# Altium project ai_uwb_smart_flashlight.PrjPcb (part 2 of 6)
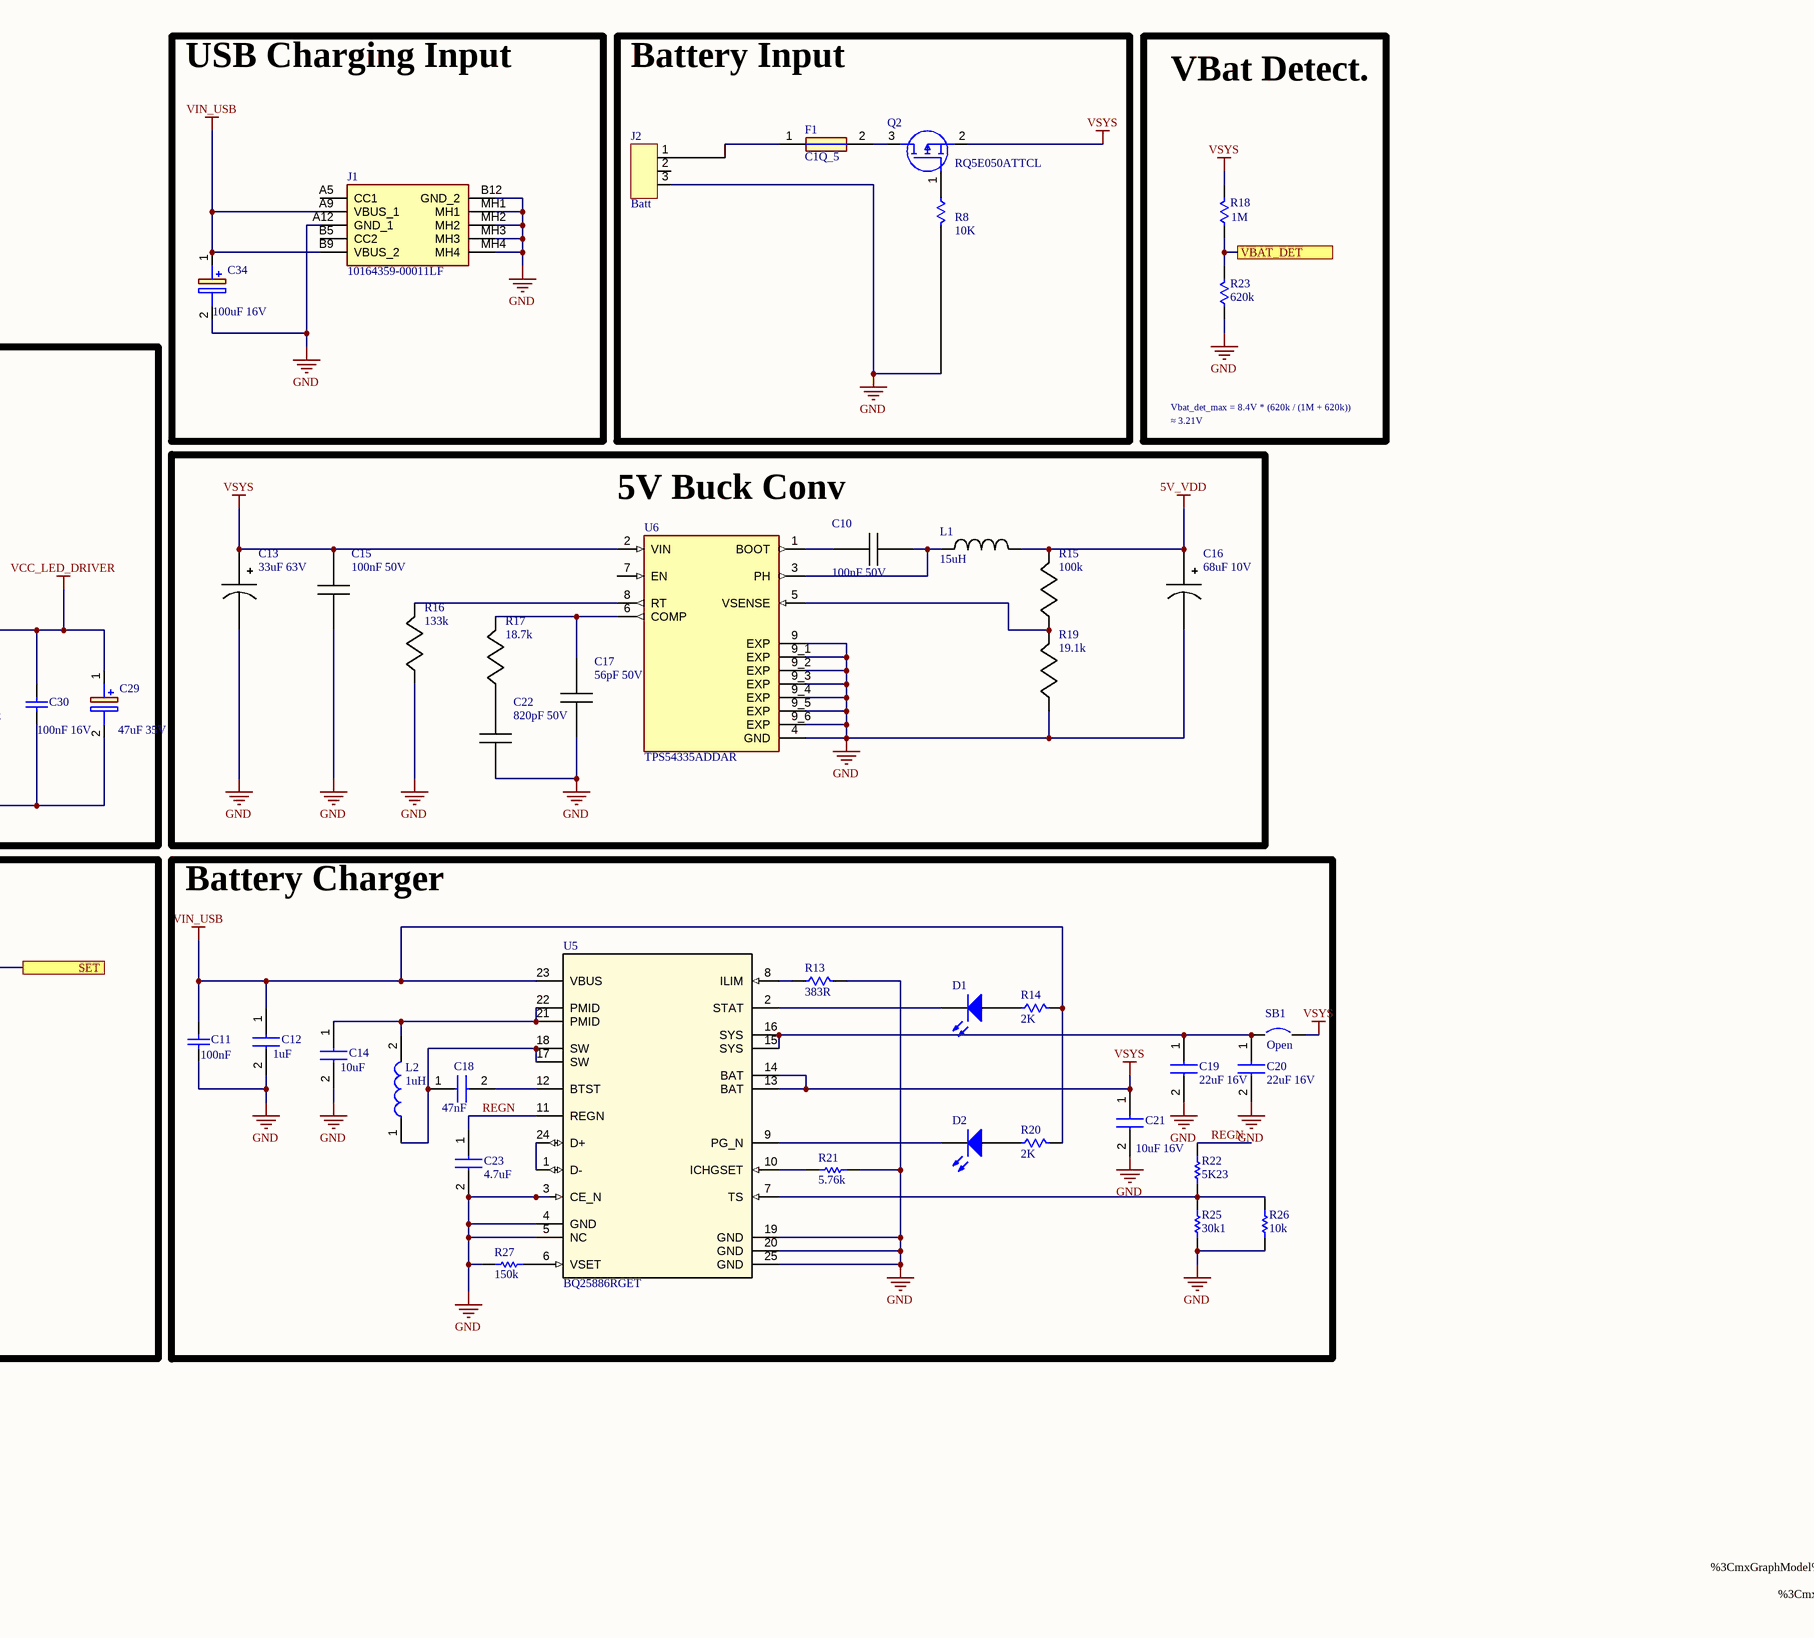
[diagram p4: Power supply.SchDoc, right]

## Sheet Power supply.SchDoc (continued)
- %3CmxGraphModel%3E%3Croot%3E%3CmxCell%20id%3D%220%22%2F%3E%3CmxCell%20id%3D%221%22%20parent%3D%220%22%2F%3E%3CmxCell%20id%3D%222%22%20value%3D%22%22%20style%3D%22shape%3Dimage%3BverticalLabelPosition%3Dbottom%3BlabelBackgroundColor%3Ddefault%3BverticalAlign%3Dtop%3Baspect%3Dfixed%3BimageAspect%3D0%3Bimage%3Ddata%3Aimage%2Fpng%2CiVBORw0KGgoAAAANSUhEUgAAAvgAAAKtCAIAAADdA43wAAAgAElEQVR4Aey9D1xUVf7%2Fj%2FiP8Ufin2VFHJ0sSbGvkBuFM2zUx93YYNFURLdNxDJazNxNTKsPsmnpWqmYYok6iPz%2FM%2FwbuMhMoEJ6%2BWP%2BCYNUSsUoEy0V%2F6DUfppfzFtPx3tnLneGgRmG933MA87cuffc93mde8953vf55%2FAzbqgAKoAKoAKoACqACtipAg52mi5MFiqACqACqAAqgAqgAj8j6OBNgAqgAqgAKoAKoAJ2qwCCjt1mLSYMFUAFUAFUABVABRB08B5ABVABVAAVQAVQAbtVAEHHbrMWE4YKoAKoACqACqACCDp4D6ACqAAqgAqgAqiA3SqAoGO3WYsJQwVQAVQAFUAFUAEEHbwHUAFUABVABVABVMBuFUDQsdusxYShAqgAKoAKoAKoAIIO3gOoACqACqACqAAqYLcKIOjYbdZiwlABVAAVQAVQAVQAQQfvAVQAFUAFUAFUABWwWwUQdOw2azFhqAAqgAqgAqgAKoCgg%2FcAKoAKoAKoACqACtitAgg6dpu1mDBUABVABVABVAAVQNDBewAVQAVQAVQAFUAF7FYBBB27zVpMGCqACqACqAAqgAog6OA9gAqgAqgAKoAKoAJ2q4DDT7ihAqgAKoAKoAKoACpgpwog6NhpxmKyUAFUABVABVABVOCnnxB08C5ABVABVAAVQAVQAbtVAEHHbrMWE4YKoAKoACqACqACCDp4D6ACqAAqgAqgAqiA3SqAoGO3WYsJQwVQAVQAFUAFUAEEHbwHUAFUABVABVABVMBuFUDQsdusxYShAqgAKoAKoAKoAIIO3gOoACqACqACqAAqYLcKIOjYbdZiwlABVAAVQAVQAVQAQQfvAVQAFUAFUAFUABWwWwUQdOw2azFhqAAqgAqgAqgAKoCgg%2FcAKoAKoAKoACqACtitAgg6dpu1mDBUABVABVABVAAVQNDBewAVQAVQAVQAFUAF7FYBBB27zVpMGCqACqACqAAqgAog6OA9gAqgAqgAKoAKoAJ2qwCCjt1mLSYMFUAFUAFUABVABRB08B5ABVABVAAVQAVQAbtVAEHHbrMWE4YKoAKoACqACqACCDp4D6ACqAAqgAqgAqiA3SqAoGO3WYsJQwVQAVQAFUAFUAEEHbwHUAFUABVABVABVMBuFUDQsdusxYShAqgAKoAKoAKoAIIO3gOoACqACqACqAAqYLcKIOjYbdZiwlABVAAVQAVQAVQAQQfvAVQAFUAFUAFUABWwWwUc2nBDBVABVAAVQAVQAVTAThVA0LHTjMVk9Q4Ffvrpp5%2Ftd%2BsdeYipRAVQga5VAEGna%2FXF2FGBLlXgl19%2B0dnv9t%2F%2F%2FrdL1cPIUQFUoDcogKDTG3IZ02i3CgDo2KVPR6fTIejY7Y2LCUMFulEBBJ1uFBsvhQpYWoFffvmloqLi0KFDJ06cOHfuXHNz8%2BXLl2%2FcuNHa2nr79m1LX83y8d26devmzZstLS0%2F%2Fvjj999%2F39jYeEq%2FNTQ0NDY2IuhYXnGMERXofQog6PS%2BPMcU25ECv%2FzyS25ubmlp6eHDhxsaGpqami5dunT9%2BvWbN2%2FeunXLxhN6%2B%2Fbt1tbW69evX758%2BcKFC%2BfOnTtx4sRR%2FXbs2LH6%2BnoEHRvPQTQPFegRCiDo9IhsQiNRAcMK2Dfo5OfnT58%2Bff78%2BUuWLFEqlaWlpQ0NDYaFwL2oACqAChhRAEHHiDC4GxWwPQUOHTqkUqliYmLmz5%2Fv7%2B%2Fv4OBw9uxZO%2FbobNq0yYG3DRkyxNvbe%2Fr06YR%2BLl68aHt5hRahAqiArSiAoGMrOYF2oAK0AhcvXjx06NCGDRuAaYYMGcKr8dt3ENA5cuSI%2FTVdbdq0ydGxj8GEc3YS%2BomJiVGpVOj4oe8lDKMCvVwBBJ1efgNg8m1FgYsXL4K3Blw1nIqc%2F3VAf8dBkr7nzjWCR8cuQSdBGSeTSka7O41ycxrhOnD40AEug%2FsNkvR1GujYr28HAETQR6lUHjp0yFayGe1ABVCBblcAQafbJccLogJ6BcSTjaNjnwH9HQc79xs%2BdMDIEQNlUgn5NDXZP%2BiQxHICAECuwwcMHdJ%2FkKSvMPog9%2BBjhwr0WgUQdHpt1mPCu1sBkWRDY80I13uwhlPTy6SS3gw6fDVGuzuNHDHQdXi740fY64Pc0913P14PFbCeAgg61tMer9wLFLh48aJSqZw%2BfbqxTjYODg79%2BvYZJOnrMrhfh1jDr9oBdMrKyuy46YqfavF7CPoMdm5HH34LIOwZMmSIv79%2FTEwMNnL1gocSk9jrFEDQ6XVZjgnuagXEwM2A%2Fo7mkQ2njo9YOCc3N9cuQUerLfGbMoGTXvO%2Bbtq4JkEZ9%2Bvf0e5O4z1GvPFGlPMgo01dAD0bNmxA6OnqJwXjRwW6RwEEne7RGa9i5wp0CDf9%2BvZxHtR3%2BNABo9yczKutDZ7l6eFsr6CTmb7TYJJN3Tk3NICsBjY3NKCl5apOpwOEGu3e3sfZZXC%2FAf0NO3sQeuz8ucXk9Q4FEHR6Rz5jKrtGAZVKJdAsZSm3jcGqPSpybKnKl2UU9go6VQdSWUahjPUKCx1lUAHxO5ctjdDpdBEL50CAgA4dAzRyDR3S31jnHgI9OHa9ax4mjBUV6CoFEHS6SlmM114VaGho2LBhg7FB4AA3nLFRdIXa%2BXDgVFeWUZCPfYMOJFMZ6%2BXj7WK2dBEL5%2Bh0urmhAb8OVk9QxhkEHU7ko92dXIcPMNatx9vbGzv02OsDjumyPwUQdOwvTzFFXaLAoUOHYmJiZDIZv0MrNEu5Dh%2FAqSy74iuHcuzeo0N4rlTlazbrmAE6JO%2BEm7eGDBkyffr00tLSLrnnMFJUABWwhAIIOpZQEeOwXwVKS0vnz5%2FPhxsHBwengY5Dh%2FQf7W7JPjekfjUY8PF2IRU%2FBL4%2BHmuvHp0jn5V9eWgFnd70%2BMkGZRHYqdUUzg0NgBYrkzw6BuMEN89g5378OXuwYct%2BywBMWY9XAEGnx2chJsDiCkDPYoONU%2F369rHIaCmD9WiHOwuSfEjFf5x9BRJur6BTV1fX1tb2w4Waw3tnkVRHRY7tUCVyQGCAr06ng97H0FzlN2VCU1OjTqfTagrJYeYFRo4YCB16%2BBCMDVsWfyQxQlSgMwog6HRGPTzX3hRQqVQG%2BWZA%2F3bnDadG9PF2SY%2BfzDKKUpWvSRUwxBMS7Aa9idPjJ4cEu3Ei53%2Bl3TnHKuYT6e0bdNra2q78UE9Ap1Tly1dGYE%2FEwjktLVdbWq6CO2fF0hk%2F%2F3T955%2Bu3249L0ZzTszroiewjF%2Bpaooy1stfPgx%2Bhbatwc79kHjIPYkBVMCmFEDQsansQGOso4Cx9imDfAPVm6eHM9S%2BNZoACKyLNmHSl5BgN%2Fr0UpVv4FRXTrXK%2BRoTNY7U99evniNK2T3otLW1nT2xg6SdEAZHnw6%2Fku5NJMtMYp3Nax9mGT%2BW8Tu8NwRwh9NnSIB4%2FP39N2zYgKusk5sWA6hAdyqAoNOdauO1bEuBQ4cOLVmyhP8iPqC%2F4%2FChHfQsBuz4%2BnhsW1tb680fa7QBJjkboBHqyg%2F1bW1tzU17YRy1cFUN3iOWUdRoAmgdewPo0E6dyPAxwkIZ%2BxUEbG7aSzQ3qdMPkFbrzR%2Fb2tq%2BPh7LMn5RkQ8YvBYhHs7S69CPR6VS0dmHYVQAFehqBRB0ulphjN%2FmFGhoaDA4fkoM35CKTf9%2Br%2FjhQg0k71jFfJZRcF7xycH8QDuvaH%2FjFZZRqJN8%2BIfRe0gHHdI7By7dG0Cn9eaPxKMTEzWOlkV8GAQkt6NJbOovH8Yyii8PrYDTf7hwiGX8OvThCRDP9OnTceZlkhcYQAW6VAEEnS6VFyO3IQUuXry4YcMG%2Fvhwp4Ed%2B2%2F4tWlU5FhS8xF%2FA%2F8wY3vAu3D%2BrLqtre2br9JYRtFhrUlAh%2B6g09bW1htAp62tjYCOGd2hIBeUsV4sowAn3PmzapZRiPfoQEtljTbghws1rTd%2FPM6%2BwjJ%2BkeEyY%2FnL2S9APDgfjw2VEWiKnSqAoGOnGYvJohQ4dOgQf4g4jJ%2FiVEjiv3p6OKupMVAsozCpwwfpL0Lq7w69QeBD4riC2tracnJy7HKtKxh1BdnY%2FG176x58TNKZzlDwypB4flWyw35R9OlhoaPoczv0wNHnkjAQD3%2FFCejEQ92zGEQFUAGLKYCgYzEpMSIbVECpVPJdOIMkfS0yc7Gnh3NM1Dh1ko%2FIYVOktoNA4FRXZayXOsln89qHO6QcmVRC%2Bi%2BzjOLsiR1E7d4AOvQIc08PZ46S4r%2F6y4dtXvuweM05MUOWpcdPNrv5jEQ4ys2Jv8bWkCFDlixZgk1a5N7GACpgEQUcbuOGCtidAqdOnQoLC%2BP0Mu7Xt0%2BHXYxJPWSDATLOi2UU1ZqAS99XQ77ZMehAAk8eXU1cKR028NlgxgmbNMJ1oPOgvpx71d%2Fff%2BfOnXb3XGKCUAHrKICgYx3d8apdpIBKpeK7cAY797PsmuHCVVfX%2FRoZPoZU%2BdWagK%2BOb2y50mjHoNNypfE4u4gk2aTu3l2XC10R82h3p6FD%2BnOatIYMGbJy5cpTp0510cOC0aICvUQBBJ1ektF2nsxTp06tXLmS81psXi%2FjrqjGLBWnp4cz9Kil6357BR1YvZxOaeeXMbdURnRdPCNcB3LmHoRB6TU1NXb%2BDGPyUIEuUwBBp8ukxYi7RQGVSjV9%2BnQO4rgM7tedS1B1XbXHj5nPOvYLOu2D0cinN1AOyW6DfZa9vb03bNjQLU8VXgQVsCsFEHTsKjt7VWL4rVQ9vRcOqeeEA54ezmGho2D5CJZR2D3oqJN8zJ4NWVhJ2%2F91hOtAg%2B1ZFy5c6FUPOyYWFeiMAgg6nVEPz7WOAnzEMWmuP9uv3sRY6OnhHDjVNSZqnL2Czt5PkqMix%2FZaxKHvgZEjDLRnLVmyBNuzrFMA4VV7mgIIOj0tx3q3vfyOOIMkfe2jozFdsYkPq7KT7XXCwOrqytVvLxcvhd0fOdq9fUR6v759SEMtdt%2Fp3cUhpl6sAgg6YpXC46yrAB9xXAb3s%2Fu6rcMENjU12ivofPnllwnKuA4V6G0HGOy%2B4%2B%2Fvj94d6xZQeHVbVgBBx5ZzB227zZ8Rp5d0xBFZfyPoiBTK%2Fg7jd99B3MESExUwqACCjkFZcKf1FUDEEVM3I%2BiIUcmOjxnl5sSZb9Df31%2BlUln%2FAUYLUAGbUQBBx2ayAg25qwAijviKGUFHvFZ2fCQfd7y9vXFu5bslCv7v7Qog6PT2O8Cm0o%2BIY2pljKBjqmJ2fDwfd7Axy6bKNzTGWgog6FhLebwuVwHO6lTYF0dMlYygI0alXnUM4g63ZMHvvV4BBJ1efwvYgACcEVV8xPGXDwuc6mpedeXp4RwS7Gb2dCw%2B3i6BU13FrC5u0LyuthxBhy87aG72IuedyTIfb5fO3GxwaYvcbIg7NlCwoQm2ogCCjq3kRO%2B0Q6VSkUlBHBwcDCIOWQSgVOUbEuzGr9gE9tCrYCpjvUytQuiFpUxdN9tfPoxMXmyG5WGho0jC0%2BMnG7McQYfOfU8P54IkH9DNDM0Dp7oSzdVJPqay9broCeT0zWsfpg3rMKy3%2FDGW8WMZv1LVlKjIBzo8hT5Ab3n7uXA6sZyDO0OGDAkLC8NZlXtnYdubU42g05tz35pp58xuzEccKMeh5qivWX7yyGqWUZSqfI1V%2BXS5D2Efbxc4%2FevjG49VzGcZhTLWi3%2BYsT2b1z7MMorDe2edPLL68N5ZLKOIDB9j7GD%2Bfqhxj7OLiOXivUriLUfQoZW3iOYnj6yGu0Wd5ENHLhwGMK3RBJDTY6LGCZ9C%2F5oeP5ll%2FI5VzD955B3gFfF3i6eHM5xSX7OivmYFsA4d%2BQjXgfTILFgU3ZoPP14bFeheBRB0uldvvNrt2xzEcXTsM3zoALpcJmF4w66vWQ6ynf1yO8soxC%2FuCG%2FYF5r23r59%2B%2BaNH6D2Es9JAElw6cuX6lhGkR4%2FmdgmHADLj7OLaMvFc1JM1LhfuUqM5aaCTmtr6w8%2F%2FHD27NnGxsYbN26cP3%2B%2Bubn55s2bbRbdbt26dfny5XPnzp09e%2FbmzZvnz5%2F%2F%2Fvvvb9y4cfv2bfo6t2%2Ffbm1tvX79%2BuXLly9cuHDu3LkTJ04c1W%2FHjh0zdcJAfX3fDqag%2BXdn1CyjEE8bUZFjWUbxTUManA53i3ja0JOK4tqVRrjZAMqFbxLyK5DK4b0hcOlL39ewjJ94D2JYqJRl%2FIjlwDrEqUOuMsJ1oNNAR%2BJAHTJkCC4RCoLjX7tXAEHH7rPYhhJ46tQpb29vUtQ6ODgIz24cEuzGMoqTR1ZDGr5paF%2FOWjwugEvm0vfVcDpUXeK7brCMoloTQORjGYX4V3x%2F%2BTCWURBEM9VyQDSO5QYr3bmhASbNjHz9%2BvVvv%2F22rq7uxIkTV65cOX36dFNT040bN2j%2B6Hz45s2bFy5cqK%2Bv%2F%2BKLL65du3b69OnGxsZr166ZBDqffFIyaaIJLZWgOYHLToLOcXYRyygMak7QgQ6AM%2BnmjR%2FghgFKpg8QCOsdeO3uHDjXVNCJDJfRoHPyaLtPiA86YABnmkGZTIaj0MkzjgF7VQBBx15z1ubSxRlUNUjSd7S7k0DpL5NK4B29WhNw9svtwAosoxDvkgG3yrGK%2Bd80pJ082t7yJZ5UZFIJcNJxdtGFpr0ASVGRY4UNJr9axPLDe2eJsRxA5%2BjRow0NDU1NTZcuXbp%2B%2FfrNmzdv3brFR5YeBDq7EuKJnmICnh7O4Fb56vjG786oqzUBLKMQ36kL7pZqTcA3DWngO2QZhZjrwjHghIO7BSBJvEtGJpVA09XJI%2B%2FoLf8Ly%2FiFBI8UeXW95X7Vmr%2Fctby9p47AuaPdnYYO6e%2Fo%2BNuaWTgK3eaKSzTIogog6FhUTozMkAKcHscD%2BjuKX4YTnDrwfmxSuxUU9AAr5HTxL%2BiAWVBxwuni263g0hzLxUOSQcsNvqD7y4dFRY6lQefbb7%2B1G9ApKkiMDB9jUpYBrJDsNgk1ZFIJ3XWdZRQGNTcGEJ4eznTXdXWSj3jfoUwq0XddnwJdbVjGz9S%2BzNB6RU4XY%2Flod6fBzv2Ie3XIkCFLliwx9PjiPlSgxyuAoNPjs9CWE8BpqzLW49hY5QH7fbxdIsPHREWOFe%2FLoSMMnOoaGT5GfM8e%2BlwYmh4ZPka8Y4A%2BvessD5zqSoYXmQQ6fB%2BPFfcI99GpOtDeUgldyMVnvaeHc%2BfvlsjwMSZhCmS6p4cz3Gzm3S16y2VRkQ%2BITyx9s%2BkvbfLpI0dwO%2B5gS5Ytl6hom3kKIOiYpxue1bECnLYqYz2O6cIaw2IU4Dge7B50oGOvGC%2BFGPXwGL4CnI472JLVcemGR%2FQoBRB0elR29RBjOW1VgyR9%2BWUr7jFPAbpF7PDeWWe%2F3N49oHPjxo3m5uYrV640NDRYyglEe3Sam5s5o66OHt771fGNpB2qVOVrUjOWefL22rNGuzsNHzqAdNzBlqweUtaimaIUQNARJRMeJFIBTluV00ATuuP02jrGpISTiv84%2BwpkSveAjqXgho5HGHTq6upu3759%2BVIdTGJk6jRIJqmKB4MC%2FI472JIlsujDw2xZAQQdW86dHmYbtlV1dX0JQ3tYRkEo5%2Fbt25YCnYaGhkpLbBcuXKBpRiAsBnTItDRAeOjU6ep7TCaVYEtWDyt50dyOFEDQ6Ugh%2FF2EAthW1Q3Vj0wqIWtKwMR0kDOWAp3W1tbLly9%2F%2B%2B239fX1x6jt7NmzlwxtDQ0NJ6itsbGxubn52rVrAmTD%2BYkPOidPniQTBoJHB9JIxnubOhype%2FLF%2Fq4CLVn0mKywsDARJQEeggrYogIIOraYKz3LpunTp5MCsV%2FfPiNcB9pfuW8jKQKvRg01jSF4dCoqKr744ovGxsaLFy%2FCJDpwCxmcSodDG%2FTX27dvX7ly5auvvqqjtlOnTtHHQLi1tfXMvdvFixdNvdytW7du3LjR2tp648aNK1euXLhw4ezZs1988QWwDg06MDO1SZNT20iW9WgzRrk50ZMpe3t7f%2FLJJz2rdEJrUYHbt2873MINFTBXgezsbII4Dg4O2Om4S2s1sgDWcXYRnWO5ubkVFRV1dXXnzp0D0GltbYU5iDkzEfN5hbOnm0GntbW1ra0NcMcg6NDJBMgrVfl2qcgYOV8B1%2BED%2BvW9M7ugi4tLWFgYnS8YRgVsXwEEHdvPIxu1kO6R069vH%2FFzAPJLUtwjRgECOscq7qlp8vLyuhR0vvrqKw4PAZ3c69A5Y4ZHhwM6zc3NHI8OfesD6Jg0t7UYVfEYMQqMdneilwX18vKqqamhcwfDqIAtK4CgY8u5Y6O2cRw5OEGOmKqi88fAshKwAteN65fIzUFAhzRdEY%2FOxYvNp46uPn%2Fy%2FbYLW8nn%2FMn3Tx19Z%2Bm%2FFka8tGD%2B%2FPlnv1hLfmr7Pu7M8XfD58%2BZMWPGjriXvzv33KXmkBvX5rXdeuGbhjffWB4xf%2F78d1ct%2BuH0hrYLW6%2Bd23jlzAdfH337rRXhs2fPjnptwaXzS9puvUA%2BRw78e%2F78%2BYtfeeE%2F7yw6dfSdK5cWk5%2Fabr1w9svoIwf%2FTXt0BEDn2zMFADomrT%2Ffec0xBloBupOyi4vLq6%2B%2BSm5CDKACtqwAgo4t544t2kY7cnD0OF0NdEOYLDLwVe1GcnMIgE7DyaMso%2Fi6MqDt9FzyOXXwaVjFyXlQ3%2Fuc%2Bx%2Ff9z%2Fkp7bTc4%2Fv%2F5%2F79CsDrFzqcaXZpa21P3y%2BrPF0H%2BHk4ODw1z%2F%2F%2FvzRYHLK15UBf%2FBycXBweFI%2B%2FJtTUnJ8W2v%2F3F2P9unT3mcL5v754bth9K%2BHyx7dl%2F8nkaBzeO9MAB3zJh3uhqzpJZcY7e7kMvi3hSPQtUMeQwzYsgIIOracO7ZlGzpyrF6ZkbWcqjUBF74pg%2FsDQIfujEw8Oj0IdK5evWrMo3PySPuCrPCxehagATKpZOSIgQP6O0L%2FPHTt2FYxjdYYUgBBx5AquI%2BnAMeR0%2BHC41gfdJEC9DKlJ4%2BsvnyprkPQOb7vf76uDCCfw9onaI%2FOYe0T5KevKwNqSv5IPDqnjjz0de2D8Dlc9ijx6HxZ8SdyyrGyJ4lH5zg7iRz%2Fde2DHI8OHdvXtQ%2ByjIL26BgEHf1sgXd8OSYtRd5F4mO0RAFYAp2MRUDXDq%2FIxB02pACCjg1lhm2aotVqSXHm4OCAPXJIWW%2BVAGeV7PZ1oNSvHixdcfjTmOPV7355eN2pz9d%2FVbvhvf8s%2F3dM1JJX5hJfCCcgk0qg6WrlUg%2F6p%2FdWTujTp32IzUMPOnM%2BsN99hJOx%2Fbm7HqWj%2Buuff083XdE%2FQXhf%2Fp%2F%2BHRP175VL161ZdvLo%2B%2FWf%2Fefzqnc%2Bq4ip2R9dUx5dqZ1Pn2Lq8u9WyZ3edlHstWObhTZaxVEAQYcjCH69RwHakSMwtCpwqmtM1Lh10ePNm7g2JNhtXfSEqMixZpzu6eEcFTl289qHI8PHmFHN%2BHi76C2fYF7nD7A8JmqcGZbLpBKw3NQq3NPDmUyRTKMAhNVJPiKXvx46pD%2BfXGHnIElf4Y%2B%2FfBh8fjdswCBJX2jI4Iy8gylYODtlUglovnntw%2FSS8iHBbmQ6RH6i6NyxlOZmrE9OLDfvZgPL10VPMPtugcdEZP7Sj4OPt0tU5AP6x0RG7xcZDgkeuS56gkHLOQOyYEHQewoR%2FIIKWFsBBB1r54CtXv%2FkyZNeXl7ElyMwR05U5FiWkZPPuujxIktPOCw9fjKp2EpVviYtUk1GXEMM6fGTTaq9wkJHkUuzjGJd9ASTLCddg2F5bboy7jAevuWm1l4Al%2BokH0hCqcpXGesF6EDqY2F2HOXW3rmY46ID0BFomvT0cKaJpFTl6%2BPtMnzoAAcHBw7TOA107Ne3D0cK0s0IzKZnOgZmpe%2BH9PjJHArsjOZ8y00CDgHLOWk0%2BJVuc2QZBQ15Bo%2Fn7ORobrrlfixz50NrzrmKwa%2FroieQc1nGLybKg3%2BY6%2FDfFgR1cXHJzs621YIN7eqNCiDo9MZc7zDNdL9jR0ehyY71Y57bKefbMwWXzlfpR8fIxZfCgBrH2UWXzlefa0hlGYVJE6VApfhV7cbLF%2Bvqa5azjCImahy%2FFDa2B%2BpaveXVMK7HVMuPVYQRy02ayw6qvfqa5cRyUzHLWKLo5c2BwIyxo3mgQyy%2FdL4aNFfGeokHHb7m4gERklatCbh0vhoGnJuhOdxs0MHZpMHqtOXH2UUsoxDv1%2FGXD4N5AWjLxUO5HjUUYPmZL7ebur5pQdJjLOMH9%2Flx9hWW8YsMF%2BvX0RO5X7XmL5fOV186X80yfqWqKQahfLT7PdMo47yCHRazeEC3KYCg021S95gL0c1VAo4cqGj1dY%2F8zJfxkDw9rMjFv61CrXn5Yh2cfqwijGUUBotRg%2FU6VB5w7o3rl0xaIgBe0E8eWQ2nX%2FimzKT3bI7lUPOZZDnLKGjLTSI8g2rIpBIy145%2B4c%2F2yhhYx%2BDx5oEOuBZoy0tVviJBB%2Br7%2BprltObGCC8wwFd3d1Nlp8ikkvVr5tzdofvpp58AVoxhHD%2FJBi3nH2ZwD3jgyJzU%2BirfBBcgNDV%2Be6YAEm6q5QD0cO6tW7eqNQHiCQ9I5Tj7CpyuX0zDT7xTJzJcxjJ%2B5xpSKcv9QoJHGlRJJpXAnQCeYOyhTLIMA9ZVAEHHuvrb1tVPnjwpk8lIcxWnUcNg0abHBflxNhJSUl%2FzOsvIxb%2BjcyoAcKsYvJDBnaUq32pNQMuVs7du3YK6R%2Fw7OlS6pOqCukf8OzpYTioAsFz8O3pBkk%2B1JgAIDxZySo%2BfbDCNJu0kjXEwoyBowjIKgzRgHuhApXvlh%2Fpffvnl2tVGgEuTQIdoDj68yPAxIcFuEG2pypf45IBpVNkp9XW1Op1u08Y1Op3u55%2BuX7105JdfftHpdF9ULjYJi%2BESl85X37p1q%2BXKWZPch0CQh%2FfOhPsc%2FEmcZjWBnIoMH8MyCjL7EQC9ePchNNiB5QD0MG5O4IrkJ73lfof3zrprudpY8xM5hQ6EBI9kGT%2FyPlBfs4Jl%2FAG8gFYAACAASURBVIQt5ww%2Bx2Ys2yrle6U1CDq9MtsNJZpurhrQ35HT34Iu%2B%2Biwp4dzevwjLCM%2FVhEG7VYsI6cPEA6DW6VaE3CcXQSsYOz93mA8QBtwOngvxDOW3vL27kHHKsLAHyO%2B8pBJJZ20XN%2BxSWGe5QalgJ1QoVZrAkgOC8hiHujAJU4cfkOn033%2BaTiM%2BhYJOjKpBOpsWnOIEOyEv%2BBv0Ol04MiZNNFt08Y1c0MDdDpdc1PxkX2zvjuTqdPp6qoWm0SHQIG05uJdj8Tyw3tnkrtFvAOPeNrIfW6SA4%2B%2B2UAi8UQuk0r03sd21oF2K5bxM8nyUtUUlvE7zr5yeO8slvFTJz0mcAfCT6PdnQbrp52Et6Zp06aRGxIDqED3K4Cg0%2F2a2%2BIVp02bRhw5LoP7dViQ0Qf4y4cB67CMXJ30qPDbHn0ihOnhNuI96nCup4czdF8QqM75VyR79Jbf6QqtTvLpZsuB0syot4j9%2FADUiCyjOHlk9aXz1cJVsnmgI5NKwPIabQDLKMCrIR506OHx6iQfYvDhvbPONaRCpx9wQRHQgWROmuhWVVlBmq50Ol1x9oviXWgQCQ1VZtxsdFdog04yfo6QPYFTXcGlBD4wUy0nvjqWUZhr%2BZ3OyKZafvcxaT9dnfSYeMtHuA4kq4FiM5Ytlvu9xiYEnV6T1UYSymmuGuE6kBTNJgV8vF3EvyZyYvb0cDYVMugYPD2czb40jHY2%2B3TrWk6LQMJ0ZQwUZcxJZjboQGcgWjTxoAN2kiwjoAPtjzeuXwLHXkzUOBp0%2FKa0D4ibGxqw%2Bu3lq99erspO0el0c0MDSKrFB6ybZT7eLuJBgZOonmg53UPZxcVl586dRsoh3I0KdKECCDpdKK7tR003VwlMk8MpcPGrLSvA8XIJvP13BnQ4CpgKOuR06CnFMgrSIb1ac8dRpNPp6utqAW5IHx2tpnBuaAC4dgIDfEk8GLBZBTgT7WAzlu3XC%2FZnIYKO%2FeWp2BTRzVUdjq6y2WIUDTOoAHGZGPwVdtoC6JC5bao1AV%2FVbgR3zq%2BrQ%2FjLhy1bGkEaqurraidNdNNqCsmeqsoKgaThT7amgOvw9pmWYPPy8jp58qTYcgqPQwU6rQCCTqcl7JkR0JMBihld1Q3l5rKlEfV1tfDRagplUkmCMg66o8qkEq2mcNnSCK2mMGLhHJlUAj02%2BO%2F08LpPW7v67eUk2vq6WlV2iio7mezZtHENfTAJzw0NgGOqKiv8pkygo1399nKtpjBBGUciqa%2Br1Zv6W7RgZFVlBd9CcgmZVBKxcA4dCUQLaZdJJars5NVvL4fjScJlUklVZQU5a25oQGCAb1VlxaSJbiRmWsn6uloSITkAAl0NOs6D%2Bjo4ODgP6su5LucrZ%2BIfug%2FK3NCAZUsjli2NgFMmTXSLWDiH3sOJCr%2FasgKc0VharbZnlp1odc9TAEGn5%2BVZJy2uqalxcXGBVytHxz4jR5jZKcfiRSq8rzc1NTY1Nep0Oq2msKXlan1dLVxIp9ORvqjLlka0tFzV6XSkCiTGJCjjdDoddOmAnXAWRNvU1JigjINzyYUITJBI%2FKZMAM8BWNLSchVsA%2BqCCBOUcfCrTqeDaMkpED8Mh%2BZHTq4CKAOngzGq7BSIEzgJRJBJJTC%2BuqXlasTCOTD4qKXlKrENOqzQREUrCbbRFyVhC4IOvK%2BTkXqTJrr5TZkg9x3%2FkMcD999%2F%2F8MTH%2FSbMgE%2B5Ook4DdlQsR8H40q%2BMi%2BWZ8yz761VCFwMDkLAz1RgdHuToMk7fjr4ODg4uKyfv36TpZmeDoqIEYBBB0xKtnPMfQKnU4DHW2qrITqGbw1UPEbAx3SfiESdFpartIpbWm5Cg0fkya60T1eyTERC9snpgPaAKeLKjsZLko6iMDBTU2NNIqB7wQ4CXhIDOiQ68qkEoIvYJtWUwiUs%2Frt5U1NjS0tV4GfIOEQBt34oENHazBsQdAZOWIgvZoEySB%2BYOm%2F7rhnwCRIAv8wnU7HyTWDScCdPVEBWGYEcAcnULaf2sWGU4KgY8OZY2nTVq5cCYWLmAaF7i9ACehAfQ%2F1Oo0RgA5aTWFVZcXqt5eL9%2Bi0tFwFrwwkSiTo0IN6COg0NTWCGRCVQdCBKX3Fgw6xh4AO%2BHLIX7AfaABUInsI%2BvBBh06ywdy0IOjA4BqyWohOp3thftCKJV7w%2BdOTsiF3Nw5e%2B%2FqMIofRgRfmB%2Bl0OoNm4047UIBeG8vf3x%2B77Fi6sMf47lEAQeceOez4i7%2B%2FP6Ecs8eQd2kJC1U4ebmHNibojAI%2FATpA%2BxHAhEiPDjR7ke44BCyEPTp80AG6AgtBCg7oEON1Oh0cLMajU1VZQboigSuLSEGwpqqygnAetHZVVVYACxpruqqqrCBJNphxFgQdmVQyckT7pCnAOjqdLnLhUzC4nWUUZcw%2FV7%2B7evW7q2Nee%2F7fr%2Fz1P0unk8%2FONbMrchaz%2B%2BLaP5r55JRXI6ch6BjMNbvZOcrtt7WxZDJZTU2NHRe%2FmDTrKoCgY139u%2BPqFy5cIF2PbXkMOaGZqsqKBGWcTCqBzi6EHswGHU4jCAEd6O9CIINUIdB0BRS1%2Bu3lcLxOp6PnrIODOaADbW3giQEUEwM65LrElTVpohukHTQBC6FFDPbYWtMVJAGaJBwd%2B3BA59DBjUdrjx6tPVpZsOFA6hucT3nOZvZgdfun9E0EHfpmsPswp8sOLhbRHfVBr7wGgo6dZ7std8rhlONQhdM7obKHUU6kM7KwR4fT54MwCqEl6ONMvhqcd85vygTS0Rhmc4GmK%2BhjC%2BeCnRzQ0WoKCQyBo4VcqKXlKt26BKeTFjE4DJw0TU2NMCCLNF3RoMOPlvYzQdcWUJJc2thIbOhBzBlzB7DiNNDRjI%2BjYx%2FwGup0upcWPEmoBUGHvqsxzFEAJmHCLjt2XhVZNXkIOlaVv4svTs8HaPsz5UQsnAOOHFIOLlsaQQaTJyjj5oYGwF%2FosJygjKPHVMNZgQG%2BWk0h%2BSQo4yIWziFfYZA2kBPspNunyHXbl7K6Gw%2FhKggAghA%2FDbEQBsNDbJMmuhFryaVV2Sl8a%2BeGBpADYPw8P0JOkgMDfBOUcXAWxElMhZ0Gk0wnTSaVwMBvqFo4oDN86IAB%2FR07%2BdHpdFOfegxBhyM7fjWmAD3LDs4o2MXVQm%2BMHkHHbnP91VdfJZ1yTF2%2Bylh5hPt7ugKj3JzA7zLYud8I14FkQLhl04VNV5bVszfENsJ1IPEI4oyCdlstWSlhCDpWEr6LL0t3PXYdPqA3FJSYRjEKQH%2FhLuIbYkAvAR2Xwf0GO1vnY5cPNfRnh9cz7J7cxVVE74reoRU3u1OAphzbHGBFakQMdKcCLoP7OTg4dMMUkVzQObDmsyMHPjtyIGd7dNK6BWnrX6Q%2FFXkfHKjY2%2F7RriCtXbY%2F6opu%2FiOu0%2B4MdEM%2BdufNCdfiLAKq1WrtrnjGBFlBAQQdK4jepZckA6wcHfvQL%2B7rosezjLxU9fi66PGmll8%2B3i7K2EksI0%2BPfyQyfIypp4cEu6XHP1KqelwZOylwqquppxPLN6%2BdSK%2BYLSYeveVezU3FpGduzw2QjkFiEq7XfHKpylcZ60U079e3T%2Fd01QLQUcZ60Z8ZgW59%2BvThzKPjLx9GH6OM9VIn%2BbCMoq5qsU6nCwn%2BbV0LMamWSSVRkWNLVb6QcFPvFrIeaqnKNyZqnPAVobO28DEW%2FNVvyoTAAN%2FAAN9JE91gXoDJj3jAHrjKuugJn38aXqmdt25VoKnXDZzqmh4%2FuVQ1JT1%2Bclio1NTTQ4JHFiQ9Vqqaooz18pcPM%2FX0ddETWMavVDUlJsrj175unKFYyDpdWl%2F0ksgRdOwno8%2BfP0%2FWdhjQ%2F55Zj9PjH2EZOfkoYyeJL4x8vF3gxGrN0xCIihwr%2FnT9Skbtl4bTS1WPm1QUAmARy9PjHxF%2FaZlUAh6CH7%2Bv0Ol0x49pjh%2FTFBXmW%2FZTUKDSr5%2BVospOsWDMYC38bfiyRKfTcXpqC%2BhAVo%2BClcBLVb7AOg4ODkOH9Bc4ke4TKtI5MWPGjGPHjuXn599%2F%2F%2F3kFJ1Od1a%2FwbRA8PfcucazZ8%2FOfPZp2oBlSyPoY5qaGm%2B3nr%2Fdev7nn67rdDqWUZjEOpvXPkx8QiyjKFX5eno405cTDhfoGYvEILDwu0wq6U7QgakKgNHr62p9Hxv%2F1FNPEWTXagoLknxomi8uShdOKf2r%2FgH3Yxm%2Fas1fWKY9YBLrREU%2BAGfB6aWqKSY94Onxk%2BF0%2BKuM9QLbyOzJLi4uWVlZ9lNMY0qsoQCCjjVU74JrVldXk2qG89IcONW1kpF%2FVjaztbX1%2BrWLR8vnsYycvOXTRZ7BcEzUOJaRf1W7vrW19cfm4%2BAWMnikwZ2lqsdZRv5j8%2FHW1tZvT%2BezjHzz2okGj%2BTvBMYilteykaZbrjh5ZNV%2F%2F%2FtfnU733Nxngrpg%2B9Ofpk54aOSvC1c97DnmmWe65BKvvzbTJNDRVx6Ki99Vtba2fn%2BulGUUylgvcAMI9%2B0Y4dq%2BksNg535Dh%2FQX85n0%2F8aR6raiopyc8kJ46L%2F%2B%2BdKCBQsWv7IQ1uBctjRi8SsLFyxYwBl6FhjgSw5YtjSicu%2B%2Fv%2Fp8zfWWb9ra2q78UA%2BW828MY3uAUa5fu3j92sW6muUsoxDvgAQ6PH5w0d3HJIxlFAI%2Boe4EHbIMCEwlUFyshnkEli2NgMXdzp%2FJ0ul0%2F%2Fd%2F%2F9fW1vbT7RaDkyYYEw3o8NvTBXfvlnbnirGD%2BfsBUK5ePtPa2nqmPp5l%2FKIiH%2BAfZnBP4FRXlvE7Vj7%2FrubzWcaPcBI97Hz9%2BvbyBzdUwDwFEHTM0822zqIny%2BEvFj0%2FdFQlIz9Tvw2MbjyVwjLysNBRBose%2Fk7wqUBB1traCpwk%2FkWZbWesGXDp69cuQvsX%2FyoG94A36KvaDXA6cJL4qgtK8B%2BbvwDQCQ8P7wLOCXr66af9%2FBSTvdtfsm0EdKC%2BJ%2Fco%2BDbEg474zh8w4yLxNNCZyJ92Gd7R6WP44VKVL8soOJbzDzO4x18%2BjGUU9TXL4fSL31WxjGJd9ASDB%2FN36oFe8f25Ujj9xJFVLKMQeB%2FoZtCB2ZVkUsnc0ADw6Hg8%2BHuZVAITR%2F14od1n%2Bd%2F%2F%2Fretre3alZOwBAc%2FjQb3ABYTzcExY%2FBI%2Fk7wBh3Vk0pra%2BvVy2dYxk%2FYE0ZHEhkuYxm%2Fc6dS4erASSHB7a8N8KFdjPPmzSNGYgAVMEkBBB2T5LLFg2nK4cyJAoUFeHSOlc%2F7sfn49WsXPyubwTJy8tpEyhRjAfDonDyyinh0WEZu7GD%2Bfmg1u%2Fhdpf6FbxvLyMV3EtJXXe2cBA4hU31RUZFjWabLPTpPP%2F30E0888eSTT9oO6EDVBXX2uVOppnp0xIPOpIluZGZFznIco9ychgwZMvZ%2B10kT3eAjG%2FM7BwcH%2Fh1C71HGerGM4tvT%2Ba2trWB5evxk%2BgCBsKeHM8soqjUBPzZ%2F0draWssuMsejw7Z7dK5ePgOtfrbj0SGgI5NKCLOCg%2BfsmTqWUUD7LHGwGZsgii%2BgvouMAl4n9P4%2FP3XSY%2FzDDO7Ra97e5gXuQ70XzWSPznH2levXLl69fOazslks48fRnB6KNW3aNFssgtEmm1cAQcfms0jQwB07dpAWK4FWiS1rJ1aa20fH08NZnfQo6SXDMnKTuk2QPjokBk5BZrAAJTs3r51ITjTJGySTSvSWt%2FdshTqgi5qubBB09C0CCtLXhGUU%2FvJhpHYk2vID0HQlHnRg5sa5oQF%2BU7iOE86kz1ABr1q1iu4gzzeAb7mAT4V%2FOnhlSMJLVb78Y4zt8fRwBswipwt7g0R6dHy8XaIix6bHTy5I8kmPnxwVOdak%2Bx%2Bsra%2BrJaATGOD79J8ed3BweOvNKJi2Gyw%2F8dkbdVWLTxx%2B42z9hyY1XYEnjKTa1H5RYaFSupONSc1eMqlEr3l7xyBOHx06m5B1BCsB%2FLFjBRB0OtbIZo%2BgpwQUHkbu6eG8LHKsOunR9PhHTOpKDMWNj7fLuujxcLpJlAOn68d0PKJOetSMYVOeHs76euKR9PhHOhwIQxeOEPb0cI6JGvfNmX06ne7Z6U93UdNVV3t0QkOeMamPTvvMzlNdYQSTMtYLalYLgo7zoL5QzfP%2Furj8f66uw11dh082tI0dO3b48GGursMH33enMy8%2FBt8%2FDOFYzs9WgT1hoaPS4yerk3yEMcVgDHC3qPVE0mHbrhjQ4XMbNCOa%2BhBVVVbAMvWkj85rr70G7Lj67eUwm7ZOp7vR0nC2%2FsOWH47qdDr%2BeiMGkww7YewbJNwksoTTQ4JH6jV%2FbPPah8U3asO5%2Bgf8AXXSY3oKNNq5Z7S7U7%2B%2BdxYY8fLyOnHihM0Wy2iYDSqAoGODmSLKpGnTphFfjjDlCBRwveQnWPvpz3%2Be2kNBJyjoaVNBh5%2BzFgSdAf0d73Pu%2F9CDzvzPSLch7u7uowQ3d3f3B8cO5Z%2F70IPOffp00wB4vj6m7ukQdAxSDjhOyDg4kRcNDPAlTYQtLVc9x48gTVQ07pCdZLkSkfH3iMPoKXaQdURVEnjQXQUQdO4q0aP%2B45SAJhXNnQSd0Dlz31j575Wr1%2Fx9XhgflTpsunp50eJ33lu%2FIjrG4On8CA3tsTnQeVI%2B%2FE5jx56%2FHtC8Wl68iMkK%2B7RkcegsPwCdv%2F71r%2B%2B%2F%2F75cLuczj7u7%2B5tL%2F1RevKgkZ8F%2B5h8HNK8eLA6C2NxHOHXPTD8m3T8GD%2B4QdDiD1em2IZZRqJN8DEZrbOekiW5k1pxRbk7333%2F%2Fk%2F4%2BsIc4bzhfjUXVc%2Fcj6%2FSoasqGjEXQsaHMEGkKTTkmdafouQVcJy3vDOgsXf5Gam5ham5hikq9Oyvv7TXrOCAiDDobt26D05NVBTuSM176RyTndHFfbRd0Dmhf379%2Ff0FBgVKp3Lt37%2BzZs93d3RUKxcmTJy9evFhVVWUQdJYvX15cXJyQkFBcXLxv374DJQvtDHQ47pxvT%2Bdfv3YRhvoT4hE%2FIIBz%2F4txznFOsZuvyDoiqwk8jFYAQYdWoweEkXLMKLLNBp3QOXOSsvOTVQWpuYXJqoLEjJyEtOznnp9H04kA6Lz2%2Boqk7PyUHHVqbmFSVl5CumpbYip9ruhwDwOdwMDA77777tatW19%2F%2FXXvBB0Y8QdMc6Y%2BnpQsX9VuIKDTYTcgY7d6bwYdmDrZaaAjNNxjGxa5tTAgoACCjoA4NvcToRxHxz7oyzFWDfD3mw06i5b8a1e6KjEjJ6tQk6%2FZuyM5c3tSevSqd2lAEQCd2I%2B278rISczMzdfsS1Gpd6S0nz5%2FwQv06eLCNg065fvy1fm7kxM%2F3FeaEzo7GJqu3nrrLZVK9cwzzxgEnRXLl5QUpyXv3lxSnL5%2Fb96BkuftzKMTGT6GAA2ZJ%2BbulHp3BsSJnxGKc0v3ctDhLBOBrGNzFZXtGYSgY3t5YsQimnJGuztxyj78KqCA2aCz8OV%2F7EjOiE9KS8zI2ZWu2rJjV9zO3cvejKbpRAB01m3c3H767rT0fOajhOQtOxK3Knf%2F7bm%2F06eLCz%2Bt1RSKnxnFoBRiakeRw8sH9Hf8g5fLeysn8D%2F%2BilFiOiPPni7jn%2Fveygn3Ofe3jz46ZBUOllF8VjYT5tsk0%2FMAA5kxvglyVkxWGrwH7GknvSQWso6RSgN331EAQadn3ApIOZ0po80GnWefnfHxrpStyt2b4xNiP96x6eOdm%2BMTQmbPpulEAHTCwl%2F4eFdK3M7dm7YpYz%2Fe8eE25Xub4uhzRYb%2F6Pd4Z5IP54qpHcWDDhnxxwncd999YkBn0KBBnBPJV%2FsAHZi9kDh1qjUBn5XNJF8hICZPqyrbpzw2b3vjjTdE3mBdcdh4D5OX7xUjCH0Msk7PqL1swEoEHRvIhI5MIJTDWaqTfuYxLKCA2aATFBT0wksRW3bs%2BlBPKrEf7%2BD3JhYAnaCgoJh31m7enrBp287Yj3fEfrxz7t%2BeM6NSsQjouAzu5%2BDgIDCrpEwqEQk6o92dZga5GfxMmvh7BB24FcNCR3HIhv4qciqdZUsjtJpC%2Fic%2FP7%2B4WM3fT%2FYIUE5wcPDc55575Z%2BvRa96d93Gzes3fxT78Y6NW%2BPXfLBx5eo1%2F4x6%2Ffmw%2BTNnhZhxo9KndAPogM6DndtvbAcHB%2FTrdFST9N7fEXRsPe8J5Tg69hGoy%2FEnAQU6AzpBQUHTn312wYsLF74cOSvkHl8OFOvCoBMUFPR8WHjk4iXhLyykqwGTwp0HHVhnirPaK18xkaCjX%2BHonpmXSRU%2Bd8YDYkDnmanS114ey%2F%2FY0%2FBymVTCWU2dqGTGZIZ0ZnXonHvSX8G%2FwWbOClm6%2FI0t2xNUxZ8UlX1avJ%2FdU15ZQn32lFfuKa8s3ndQXVqRXaTZsn1X1Io3zUPzoKCgbgMdmVQySNIXWcfWazKr2oegY1X5O7o4TTnYL4cu600KdxJ0%2BHUGvadD0KEPNi%2FcSdARSTniPTo06BzQvFSxd1dJ0db0pHf3f6IknZH5fZDJHnd39xWvR3xSvC0jZY2W%2Bbi8LMH%2BOiOT%2B1M%2FLfhkgjjp8ZNF%2BnJIDPyAMOjwKWfBiwu3bN%2BVr9nXTjYVVQA0Hf4tKa8s3n8wd0%2FZ5njl4n%2B%2BZuqt252gg6zTUU3S239H0LHdOwAph1%2FEm7enN4OOeMohoNMhUt8DOobm0SFMYzDg7u5u9%2FPocG5UTw9nU9dG4MRAfxUAHQ7lhL%2FwYnxiatHeT0sq2r015n1KyisLyyrid6f945VXxeNON4MO9tex3ZrMBixD0LGBTDBkAr3CA44kp0t5M8K9FnRMohyZVALdHTpUGEFHJr2zVleHWsEBgVNdw0JHhYWOMnuSQPpCxkCHppxnZ8x4L3ZLYWlFibl8w6Gikooq9Sfl67d8%2FLe%2FPy8Gd7oZdHDMuaFqBPfdUQBBxxZvhXnz5kGTs4ODA1IOXcSbF%2B6doGMq5cikEgcHB%2BdBfTsUmQadgyXPf1q6Vlu4Mi9jabn2XbIEhEFfDux0d3d%2FY9nssuK38zOjyorfrvhkzcE9IdC4Y2d9dGRSCWdBdZZRKGO9Ook7BkGHppwFLy7MKCjmkErnv5ZUVJWUV6blFkYuXtIh63Q%2F6PDnErTFwh1tsoYCCDrWUF3wmjt27DCbcvzlw2Cp6g7rKv4BPt4ugVNdzT7dXz7M7HlBZFJJl1reDaAz6eGxTz311DPPPNNhBWDGAcb66AhobgblwGyzo9w6nqKJBh3S%2BwQCIjsje%2F8%2F17%2F%2B%2Bff8j8hFPf3lw8xmBU8P587cbOTB6XCtK5lUooz14ugDX0tVvmbbL5NK%2BKBDU87S5W8WfLJffF8cUwFI%2B2l1gXY%2Ffy0Uzo1tQdCBoklk2x%2B9RsS0adMEy1r8sbcogKBjWzmt1WoJ5Zi0JvmyyLGVjBw%2BythJpDgWGVDGTmIZOcvIS1WPx0SNE3kWHOYvH1aQ9Cg53VTc0Y%2FCbb80y8iVsZNMJa3NayeSS6%2BLHm%2FQ8q4GnZxd%2Btd0xf3dBjqeHs5kzchSlS%2Bnf6vZlCM8%2BJxoO%2B7%2BQVMeHWLw83tXFzGjrsyeR4deQyo9frKpd8u66AmEPDavfZikyIxAh6AjPLw8PX6yGReFUzigQ1PO6v98ULT3gKWaq4wxUEl5JbP3wNr1mzhwQ3%2B1FOikx09mGT%2BW8StVTYmKfECMaMg6tlWr2YA1CDo2kAl3TTCbckKC3QBxTh5Zdax8XiUj37J2opgSAY4BVvisbObJI6sAGkxahadU9TjLyI%2BzkbVsJKCSyHcvmVSi9w20I059zetHy%2BcB65hnebXmaZaRG5xWH0Cnpoa17Kf5u2PN3x1r%2BeEofL4%2BVSUQf%2BTLf39Adh%2F5LF%2FssS%2FP7%2BCeWZ9Xrq4o%2FMu%2BPL%2FFLz5AfuUE%2BIIA5RxnF%2BmzTEF7CMymnOFDB%2FAvZHDPgP6OfYxs4icMNBJBH4EJA4kn6Ti76Gh5GDQDGbTQ4E4gj2pNwMkjq%2BD0qMixBo8Us7ND0CFEBZMjn6mPr69ZTu809ZWAWEWDzj2Us%2B4DZt8BY3Ri2f2aT6u0n1YLsI5FQEc%2FPt%2Fvs7JZJ4%2BsBtwR6Qkb7e40oP%2Bd9bDmzZt3t4jF%2F71UAQQdW8n46upq83w5Mqlky9qJlYz8%2B3Olra2t169dPFw2o0xlwly6ADcgxMXvqlhGvlk0J%2BnfsOUnj6yC0%2FVrFsrFc9K66PEsZflnZTNYRi6ek%2FiWG%2FRmbdq4pqXlqmU%2FP%2F90%2Feefrv9yd4OvApeIWDiHVFQyqaRU5csyChDtx%2BYvWEYh%2FhXfXz4M6k44%2FUx9PMsogPC6gXJkUsmA%2Fo4PPei8O86b%2FxHZdLXguQf55%2B6O8xbuowP9XcjSUQArIms%2BmVSi9w0oYDWG69cuskw7INKZYlJYGHQgjwjWQE61trbSi3qaPZsOAR2act5Y%2BXbR3m6iHGAmzafVe%2Fazaz%2BIpR05JGwR0GEZv2rNX0A9fdHkJ94PN9rdqV%2FfPlCoIuuQO7B3BhB0bCLfz58%2FTyhHZPMBXSgrYydVMvIfm49DYg6Xzag0ERc%2BK5sB5169fMYkt4p%2BTR%2F5V7Ub4PQz9duMuVVog0kYnEnEcnDqmAQ61ZqnSRaaZDmxwbwANIJc%2FK4Krg6VrimWK6o1AZTlCnWSj0hLoBKtr1kOpzeeSmUZRVTk2O6hHACdJ%2BXDoRY%2F0I3Dy2FJcAI6tewillGIBx1wg9Gas4xCpOb8w4RBh25iIznV2tqqr63vzLUovs7mXB1ARy6fQqhiwYsvtffLsdAAK%2FG%2Bn5KKqnztvn9GvU4sIYHOg45%2BGQ2%2Fo%2BXzIcv07wN%2BylgvjhoCX0eOGEhYJysri2Q9BnqbAgg6NpHjLi4uADrimw%2FoxzsyfEwlIz9WPu%2Fid5X1Na9XMnJ10qP0AcLh9PhHWKbdK%2FP9uVJADYMNQAYj0RdG8mrN0%2BdOpXx7Oh9cLOJ7TkAHnaPl874%2FVwreILMth4azzjRGQAIFevjSCkBNdrQ87K7lQqSSoIxTZSfTn7OnCpubim9e%2F%2Fbnn3%2B%2BduVkc1Nx3ef59AEkvnS83gAAIABJREFU%2FPSfn1DI%2F0B%2F%2Fjz1sTej%2Fhy9YsYH%2Bi16xYw3o%2F489SkfL%2F1GHykc9nn0ES8vrz%2F8wVvgMDrJJDygv6NVQAc0r9YEnDuVek6PdyaRCjiEatlF358rBUgy26fS4fBy2qPzWdlMUsoAlQIjmn31UW5Ovr6%2BBClmzJiZod7T%2FZQDPFRSUZWez%2Fz9%2BXnEHgh0HnTuOuH8Th5Z%2Ff25ss%2FKZrGMX1iolNyHYgKEdVxcXJB1yH3Y2wION3GztgJeXl5AOYOd%2B4l5dPnHeHo4g1OH9EcW%2F5oLI57Ud3sTs4w8Pf4R%2FiUE9tC9iU1y58ikEk8PZ9KbGCCpOy3nJIp%2BC%2Bf38OUczJ%2Fg31iXi0kT3cxblFGn0wmsWATVSfC0aaFz5v59Xlj4iwsXvPhS%2BAsv%2Fn1eWOcXKiKVFj%2FVVvToiNfcoNn6x%2BS3YVDqJB%2FxHjh%2BhMIeHc6inrUHFzWdzm%2Bo3UAas1hGwelCzr%2BEsT10i1VQUNCGuG3ifTBdcyS7OV5J7hkLgo6%2FfFipagr0zmEZ09w5RD1Y2MTBwcHFxUWj0Vi7vMfrW0EBBB0riE5f8oknngDKMbYOkVZTWF9XW19XOzc0QCaVVFVWBAa0dyzwmzJBqymcNNFNJpXMDQ2o%2Ffxg4FTXZZFj1dlvwPH1dbUJyjh42lXZybATeoqQOGFnYICvp4dzZPiYmKhxpPCdGxoAv2o1hb9OJRe78V0SbX1d7aaNa0jMEQvnBE51jQwf0%2FLDkbNn6shhEQvn0BZCPBEL59DRQiSBU12jIseCM0aVnczpzlJVWUHihOSTPVWVFWD5oU%2Ffv9HSUF9Xq8pOJgWcqQE9aSnqql8%2FcXgVdOCAinDSRDe%2FKRP8pkyQSSUkDF8h4cSNBDtFXtfTwzksdBStOedETn1GKpJZs0KWLF32%2Fqa4ZFVBTnGp%2BpPyorJPi%2FYe0H8%2BVZeW55XsTclRx%2B3Yteo%2F74eFLyAnmhHgmARfaY8Ou%2BevB0ue3184pzQv5MCe5%2BfMfFjMqKs3X%2FOrYP5Wlh9SUfxc%2B%2FoPxVOBAIT76MDViebiHYckFZ4eziHBbjFR48R3IyPncgLCoGNwBh2acszuHjTugaF0Pr4Y8Y%2FC0oquwRcTZlIuLK3417LltGEW8ejAu1BkuCwmyiMkeCQnC8R%2FdR0%2BAIpZZB269uk9YQQda%2BY1oRxjy5LX19XqdLqWlqvwd%2FXby3U6HXDAsqUROp0uMMB3bmgAOAzq62qBhOBgOEuVnQJjjuCrTqeDSMgxLS1XgZzoUoPECWdpNYWq7GQSQ0vLVUAoYl7EwjmTJrrV19XCMdAnd9PGNTqdDvgsQRmn0%2BnAZvhVp9MB%2BtDXlUklOp1OlZ1CdgYG%2BNKmwqXJHp1OV19XKyZaEqGxgN6dIz9xeBXcEPDyDdUh8cdAishX2s6IhXOamhpbWq6axDrGjJFJJXzKCQ4O%2FmfU8m2JKQXa%2FcX7D8JyjHvKWSMf%2FQKN%2B9nC0oqUHPX7m%2BLmzQ%2Bn6yGRYYMWDujveJ9zf8Of%2B%2B4TAzq%2Fdx1s8HSR8%2BgYtKqbd3YIOhwHEk05LKMw5v%2FrMBUc0NmelGZ1yoEltHZn5U5%2F9llyX1kKdDoUROQBw4f%2BxjonTpywZrmP1%2B52BRB0ul3yuxck0x8bW5YcmjyABgIDfOvravmgQ%2Bp4%2BKm%2BrraqskKn04HvoampEeADGAhYBI4kzh6DxQRwCTCKKjulqrICDmtqamxqaoQwUE6CMg4qeMAvIKRlSyNkUgnYRoMOIJfflAmTJrqpslNoUCBmGAQdiBCOAfsBzlTZyQBMJMlaTaFw0siFOAHoVd3w%2BXrIn9P6oUwAOhEL5%2Bh0uqamRkgdOLQg%2BWAYmKHT6YijixO5qV85lPPsszP%2B9%2B13sgo1wDdGyMYY8bDtvTf2swXa%2FbFb401arigoKMig5UOH9B%2Fs3M%2FgZ%2Fgw59%2F9zuV3v3N55BGvYN7m7%2F9E%2B6%2FDXYYNHWTw9MHO%2FczrpmbQzi7d2SHogDeCnrkHWEed5GNS%2BywnFTTovPSPRUV7P7UF0NlTXllYWv76W9E2CzqchT%2FPnz9%2FtyTG%2F%2FavAIKOdfI4KysLXKkODg7G5qIF0KFpACpaoA3ia4E6uKmpETwNBHRkUklLy1UAnarKiqrKCjgR3BItLVeh5uYUo%2FAVLgTHEMqRSSU06MDlgHJ0Oh3ghTDoAKNAtAbdOcY8OnBdgBs%2B6BDaa2pqNBatwWTSO0mv6tP12xpPpUCdRBpHAKf8pkzgpxQop6mpsYt8Oa%2B%2BFpWpLtmzn9XXZ0ZpRgz9lJRXqj8p3xC37TlxyxUZAx1aN2NhAn%2FEAQYuPWPH97j9YkAHEuUvHxYZPmZd9ISoyLFmO3KIPjTofJSQZCOU0%2B7UKa9MzFDZMujQEwk%2B8cQT1in68arWUABBxwqqazQaQjkC0x8LgE59XS2QDfhIoAsLoA%2BADmlmSlDGtbRcraqsgH45Op2OHFBfV8tvtCLl6bKlERAtnAL7OaADIEVcO9BbiNRnfI%2FOpIludLQGocSgRwdcU0ASfNAB7xGtCUmFSQFOr2q6GwcNOqrslLmhAaC8KjuFrshpKjXp0uRg2pczc1bI1p2JzD6Y6LZTiENhUOWecjajoPjNlW%2BTOkkgQAzDAEcB8aDDObGTXwno%2FO25vxdo99sO6Owpr8wr2bvw5X%2FA7WRrTVcgO2ciQSuU%2FnhJayiAoNPdqoufMgdABxwqgQG%2BLS1XwRlD99EhjUEyqQTCwDEAH9DMBDgC%2FZcJ6Ai370QsnEO6mwBRQTHBAR0gFbDTmEcHrIX3%2B00b19TX1QKvgCuIX%2BgbBB1jTVeQ2NVvLyfRgruIH63IPT7eLpHhYyLDx4Avh%2FRBpkGHkE1VZQW0aiUo45YtjQBjOuPXoSkn%2FIUXswo1nffiUIhzDyoxew%2Bs3%2FxRyOxQAcrpjEenQ8EtsuBUh1fpugNEgo6PtwtpvSpV%2BW5e%2B7BJ7VbQSZ%2F%2Bu%2BSlhyDL3vr36uI7fj4Teg13KRgx%2Bw7Ebo0H8177x8O02WS0QdfliMiY6YkEt2%2Ff3t0VAF7PGgog6HS36jKZDNw5Q4f07%2FDJhLqT1KzgI6FBBzwKULnSoCOTSsDzodUUwn5OJOSrcGdkOIy0XpkEOtCPmFyovq4WsIDsMej%2FIL9Cj2PoLUR2trRc5ThRqiorQBZyjDDDdag5fQD0m4b4Vdkp0HQFVwT2ghRpNYURC%2Bd0EnRoynn1X1H5mn36mVHuoRNj1GLG%2FpKK9tpx685E4WYsWg2zw2SoGsQA8%2F5B42Dnl%2FI226pOnigGdCLDx3D6IMNoPvHzVMEM2nQkezL%2BCCShTMnsUmoxL%2FLUHDWYl7f7CdpsCHdSc0udPnLEQByE1d01n1Wvh6DTrfKTYVYCC%2FrQD%2FOkiW4JyjitphCGVU%2Ba6EYGbAcG%2BKqyU%2BAvnBKxcI4qO2XZ0gjSJXbZ0ohlSyNIJFpN4dzQAPorYJBBJwQMDtePt%2FptDBRECJdLUMZBR2OIkIS1mkISYWCAL1yCMI3BaOkkQ3rhLK2mkMRgcA%2BJdtnSCDiApJ2O0%2BwwIbOWlqtQW3N6HEOOdJ6xaMqJWvGWurS8xOhwKkuiT0l55e7M3Nmhc6By4v81VTroCgZnNTU1wn1L9NFqCvl1f6mqfXYDUy9k9eM7BB199%2FY7kyDzq3wyj4NwQoyBzoyZM3OKS81jkS49K7tIC5MH2jLoyKQSesA5DsLq1lrQGhdD0Ok%2B1RcvXgyvEcamzOEXeUAtmzau6boP3SrENwD3wAB%2BogO%2FV9OkiW5zQwPgQw4zKUBTzitLXus2ygE%2FUEl55a50lTHWMSkhMqkEOr%2FDWdBmCpSzaeMa8Hh906BkGUXtwUU%2FNB8%2Ff64UCIBMRGTq5ax4fIegw4cbeo%2FIeXSMgc7LixYXldnKeCuanAq0%2B6NWvBkUFGTjoCOTSsiAcy8vr%2B6rBvBK1lAAQaebVCcdkPv17SOydDY4boW8HFswwK%2B8RVqIh3VeAZpyng%2Bbn1tS1j2%2BnHtau%2FYbmNkWvDumJpAPOnNDA6CrE7QAAuj80HwcHrzag%2B3rVZm96pOp5lnweGHQoWfZZhkFpLf5u0qadcSMwDIGOq%2B%2FGV28%2FyBNGDYSZvYeePf9DT0CdH6dB3Wwcz94%2BZw2bVo31QR4GWsogKDTHapXVVXB4yQwmJxTBBPKgflmuu6vBXu0cJKAXztUgKacZ2fMSM9j7uGPbmm9In6dtesNLEPdYRI4B%2FBBBw4gXF6jDWAZReOpFHjwPiubyTKKmKhxnHhs%2F6sw6ND9kEhib968Sa8CQQ%2FrM5ZeY6Dz%2FqY4GyEbjhnF%2Bw%2FGfrS9p4AOPeB83rx53VEZ4DWsoQCCTneoTtbsFBhMTpd0hHKg4wv9E4btRgGacoKCgtZv%2Fkg%2FWY4lu%2BCIx6aSisrcPWUvvRzJ6aZjqtp80AF3ztzQABgzCB4dllHAeu%2Fg4RDj2zDVkq4%2BXhh06K5IxkBHTJdkY6ATt2MXhzBs5et%2BdntSek8BHZlUQg%2FCysrK6o76AK%2FR7Qog6HS55GTNTpfBHa%2FZOd5jeFpqQpt%2BCw%2BbMd5jOPl4PvQ7Er4TGDd8%2FN1PVxTrj0waPeXx8fyPwnfCHxUT%2FaZ4Tnn8Ie7nsYemPPbQ%2BHHDu8Iee4rTe9JYGileejlSv2KRdSjnjlOnojIxI4e2yozh5VWVFS0tV6HTOpnLoKXlasTCOQA6qbs%2FSI%2BfTLfg9ER3Toerl9NNV9WaAGi6%2BqH5OJ1wMXhnDHS277aJlR8M0tXOlEzLgs7HH2%2BFz7ZtW7dt27pzZ3xiYkJqSlJaWnJ6ekpaWnJy8u7diQk7tm%2FbunXz1rjNcXEfxm35cMuWTVMee0hMoYGrfnZ5LWjtCyDodG0OTJs2zaQOyB9t3ZJ%2Bd8vKysrPzy8uLtZSm0aj2bNnT1FRUXZ2durdLSUl5X%2FfWibmkTbpmLuGtP%2FPzs5Wq9UlJSWULe1BjUbDMExeXl5GRkZqamqKfnurC4wxyXLbP5gDOrszc8V7X7ruyKKyCnoWfzNAJzDAl0zSDWuxkZFrsDDZ3WUax2xe%2B3BM1Dgy97TtZxnHQmGPjqeHM59RaMphGQUnQoNf%2BZHA8PIdyRkGIcMWdu7OyrMg6MSsXJGh37Kzs4uKijjlD%2BcrFEeZmZkpKSnJycmrV0UbVJW%2Fk3RMlslkOAjrpt1tCDpdmKXbt28HyiGrWYUEu70XPX5Z5FiD5fv7761OS0tLT09XqVR79uzhPMP8r%2FRTvWPHduHXFx9vl2WRY2Oixomcr2xl9HIAnZycHP6l%2BXtoY5KTkznGREWOXRc9Xoyvnl8G%2BXi7RJliOSeGkGC3ddHjoyLHikw45%2FQu%2BkqDzr9eX8HsPWDFditCTiXllcmqgmefnUH8OmYk32%2FKhPVr5uxnImLXPgWaw8g18e2wsGBCZ%2B6WddETRI7f5iQQ1jYX85gIg45MKtFPtN1Vw8t3JKfbAtMYtGGX3i9okVFXj0wanZGRkZWV1SHicEokhmHS09OTkpJmTJ%2FKyWL6q6eHc1TkA%2BuiJ0SGywZJ%2BkJxjatD3LS7DUGnq7L0xIkTpAPyyBEDZVJJRvwjlYwcPmWqxzn1rio7OS0tLTMzs7CwkPPQCn%2FVaDT5%2Bfntry%2BrV9LPMB2ODB9DLl3JyN%2BLHk%2F%2Fyg8%2FMml0WlqaSqXiu3A6NEatVqempq5edccYH28XlpGTT3r8I%2FzLCeyBtTbJ6es6spwTlTJ2Ejm3VPW4mMYCTgxd9JUGncSMnHbKIZ9u7INMEIcE1KXly%2F93ZWdARxnrRVwXpSpfU4GD9mGok3wMvhIYyxS6wciMwVxkCmOY1k%2FY8g5BR4B1xHRDhjTSaoCq4NGJ25loEDKsv3M%2FG5%2BYaimPTuzGD0S%2BaPHLJY1Gk5OT8%2BGHG43dLf7yYSzjRz47Nno5DXSEQnvx4sU3cbMjBRB0uiozyQzIrsMHyKSSmKhxlYz8%2BMHI5u8qz9Rvq2TkythJ5AlUZSdXVFRkZ2drzd2Ki4tTU1MNvr54ejgD5TSdzjt%2F7pMazdN8zCKWQGBl9HKzyxdoz0pPTwdj0uMfYRl5XfXr5899UnswkmXkJk2aApgCln9WNoNl5BxA5FhOf4W1q46Wz2v%2BrvJ0%2FTaWkauTHqUPsGKYgM4LL73c3juHUA4JWAl3SsorE9KzzQYdmCWvWhPQ%2FF0lrI0qcsIYyIvNax%2BGWXaav6usq36dZRTKWC%2Fx2QQo0Hgq5fy5UhjPJQwrdMx6IldUawLOnyttOp0PrEMfwAmLAR2ZVBI41XXz2oeBV2AJCJPQzRjorNu42fpMU25g6Yni%2FeyH23ZaBHRmzXg6NzfX3BLxznkFBQXh82dz8g6%2BFiQ9xjJ%2BDZ9vOH%2BuVD%2FNgd9Lz49xdOzj4ODg4uKi0Whu4mYvCiDodElOkq45ZAZkcOdc%2BfEMXO9w2YxKRg7Pmyo7%2BcaNG50BC61%2B02g027Zt5T%2FS80NHVTLyxlPJcGnArPmho%2FhHwp7Avyjy8%2FMhTrP%2FajSaxMQEmVTCMvJqzdNw6WstzSwjF%2B%2FU0b%2Bgyxs%2BXw%2Bn6ytOufi34c1rJ7KMnEzZcrR8HsvITapmjElk0v7Bzv0GSfpyPvfLRgNMtI8TJnDDD1gDd3KKS%2BeFzQfzTEopAD3LKJpO50OWwTQ54tkU6nXqblGI5yQgldqDi%2BB0mI1wXfQEkUmIiRpHW37iyCqWUQi4AEWCjsirGzvMGOi8GbNK82mVDbIOs%2FfAO%2B9ZZh6dXbt2ai2xZWVl%2Bvp48BVmGb9qTQDcLfp%2B4n6b1z6MMyaDIHb2F0HH8hlKuubQcwMqYydVMvLm7yrheuBikUklMJJca6FNo9G8tPA5ziMdEuwGziS4dH3N65WMXOBNNzExwSLmaDSal196HkDnWkvzzZs39ROm3ePK4pjK%2BQqgU3swEizX1z0mgI6%2B6pI3nc6D08Eh1P2rDQzo73ifc%2F%2BHHnSmP489%2BiCQREZBsRDoEPTpRuIp2vvpf9ZvAvNIIxQJCE%2FuB7hABlSDW0U8XMKALGDTKz%2BeYRmFOsmHc1cY%2B8oBHfDKiHcfwoDw0%2FXxcLfA6HcBRLMu6Cx69Z%2Ftt40hn4p1d6o%2FKf9n1Oud9%2Bj8658RFimFIJI178ZwbhtPD2cadPR3SzvoyKSSoUP6Y2cdeArs5i%2BCjoWzku6aM9rdiTxdgVNdKxl5jebp%2BprXwZ3zXvR4WPby7Nmz8DRa5G9eXq7vY%2Fe8vnh6OKuTHgXWOX4wkjAWsY0OhIb8xSJmQCQFBXkfb5jKMvLPymZAuxUryFi0JTA8B1q%2Bag9GktM5xwh8BU6q1jxdV%2FM6UI6pXXwEIhf%2F04D%2Bjk%2FKhxNQgMC2DU8FBQWFLXhB%2FUm5KNAB4uke3NnP7kpXmQc6pAGo9uAioBzxpCKTSoA2qjUBdTXt7VYsoxDvwJNJJdA9qPbgIvAksYxCPGOB5dBwJsZy64LOc8%2FPKywtty7TGLx6dpHmeb07sDOdkcd7DNdoNBYsiDQazR%2FlEznPrL5Llt9nZbOg3Ypl%2FEKCR8IxpGNydHT0Tdx6vgIIOhbOQ9I1hz83IDQhAWdsWdv%2B1AHolJeXay26vf%2FeO5xH2l8%2BjHSFVic9KvCeatnyRavVKndsgiYk6G0j%2Fg0bkuAvHwasAz1sBJoSOEmGr9BNBy5Nd4oyeHAX7RQAnfaJ%2FPcdNAF0ugt3MgqKZ4eGBgUFcfhMTA%2FfkGA30uCSHj%2FZJBeap4cz%2BITgusLeI35%2BeXo4012hTb1baMvVST7CllsXdKZNn56SozaIGtbdmZiRO336dFM9OiHBbiHBbkTw9997p8MSUa1WZ2dnw8jzgoKCDo%2BP28Ltlezp4azvE3anPzKhHJhFcED%2F9o7J2Fnnpl1sCDqWzEbSNWfokP78UhhcFP7yYeR5Dgzw%2FfzzzzV3N2PPak5OTqp%2Bg8khxHTQ47%2B%2ByKQSf%2Fkw4RfcDsuXkpKS7OxsGLcJU%2BZkZ2d3ODLrj%2FKJnh7OAnRlUCt6Z4eW0wdzwnBpojnn1274KgA667d8bDLldEtjVs6e0hcWvmQe6PDvc1NF7vzdYvbNBpcWfkwgOd0DOunxk9VJPvQnaevj4Gxbuz72k4OHrIs1nKsz%2Bw7%2BZ%2BOHYN72jb602RDm3wn0QDkYo%2FeHR2TGSkLYX1hYmJSUlKzfoBSCgjEzM1P4xNmzAvgGGLvZRo4YCA1YLi4u58%2Bfv4lbT1YAQcdiuZeVlQUPxoD%2BjvzHyeCe6cH%2BdyHnt%2F9aasvPzydPMgkkJyfv2rUrLy%2BPOpAb5L%2B%2BGDSA3uk9ScqN5d7vOTk5YENycjIxJiUlJTExUbgn9eYPN9AX6m1hAdBpn%2FaNgIt5ga5pzCr4ZP%2B%2FopabDTq9IYu7B3T4So57YCiQxIIXX2p3B9pSN53cPWUvL1oM5o33cOUbz98DrruG2g2wCtivfc8F%2BghqNJr09PTk5GQCOlAWpaampum35ORkzgyrdBmmUmXxDRDYQ2YRxCU%2Fb%2FbwDUHHMhlorGuOwFMkk0pWr4r%2BDXDuDWm12szMzNTU1MTExLS0NHhlAbyApzopKSklJYV%2BjOmwRqOZ8eyfhK%2FO%2BTUubhMdAx3WaDSpqalJ%2Bg3IhrAOGJOcnJyamkqfQoc1Gs3f5gZzLtd7vgqATnpeUWdBp2sas4rKPv33mnUIOgJ3qdVBZ9r06buz8mwKdJSp2TNmzhIPOjCnIum63lC7QZv3Il10cMKZmZmJiYk7d%2B7ctWsXeHQI6KSmpsIEp8Kl4iuRCwTylP8TmVnngw8%2BuIlbj1UAQccyWUe65sCsOfwHhr%2FHe5K0sLDwXrz57Vt2dvbu3bsTExNhXQXaTwvvLtB%2BJDAOPDk5iX9RY3tmTJ8q8CYE5Qvx4hBjgHJI%2BSJgzK9JMXZpu99vDHRmzpqVVVhiGdCxNO60DxJetx5BR%2BDmtDroBAUFRb3xVlHZpzbCOurS8tff%2Bm2qSTEeHQAdMtKtoXZDenq61siWl5eXmJiYkJCQmpoKTh3w60AplJGRkanfIGAkDq1SudPgUHNjGU2W%2FMTOOpapKa0UC4KOBYQnXXPIrDnGHht6%2F4cfbiwpKfkNbaiQWq1OSkpSKpWwaAu4c8i7CywTkZ6enpGRsXv3bmOPtFqtfjkijL6iQPjDDzcai6ewsHD37t1JSUngWOIYA5QDhUtHxswTMMCOfzIGOjNmzlQxn1gSdCyHO8y%2BA%2B%2B8h6AjEbgtbQF0QmbPTsrOtxHQSczMnTnrjjsnKChIDOiQMXqn6%2BNP18cXZEWrVCpjBVFKSsqWLVuys7NJEQRFIpSHmZmZWVlZ2fpNwLusUqliVr4hkK38n8jMOjKZ7CZuPVMBhxu4dU6BzMxM6JpDFrTiPyr8Pc9Om5qUlESxzT3BrKysjz76KCsrKy0tjfboEA8KeX1JS0sz1j%2BGYZitW%2BMeNzRTFsee8Pmz09LStEa2rKysrVu35ubmGjMGipisrKz09PTOG8OxzQ6%2BGgOd0DlzuwR0SF%2BfTnTfae9VuqG9V6kZo67sIMvEJMEWQKfdqbPiLbUNjDMv0O6PeuN%2FodFKfNMVvUpGReFfkpOTjXmFi4uLt2%2Ffnp6enqrfCOukpKTAyjnZ2dkqlSo3NzcnJyczM9PY2liFhYU7d%2B70%2F%2BNvs9KLyWvnQXeWwQoODu5cdYFnW0cBBJ3O6g6U4%2BDgwB9PLvAIJSQkpKWlaYxsifotMzMzPT2dxgtohwawUKlU2fpNoE16586dK6M7fn1JTEw0NmBBo9Hs2rUrKSkJPDccY2C9PShiwB5jwKTRaPTGrBDQxC5%2Fgv6Mc2eM1A9x%2F22Jx20bnmpvuirSWN6jQ0CnEw4eZu%2BBVWvfR9ARuCetBToPyO6jeWL69Onbd6cVW3XywOL97LbE1BkzZ9KGifHogLw%2B3i5hoaPit0YnJSUZGyiuVqs%2F%2BugjeN2Ctnt4A0xJScnMzATEyddveXl5ubm5xjxDDMPs2LHj3XfeFshZ%2Fk%2Bj3Z1gtLmDg0NmZmZn6ww8v9sVQNDplOTBwcEAOs6D%2BvIfD2N7%2FvXPf%2BzatSs9PV1jaCsuLt65cye0TMEsEQR30tPTs7KyVCpVDrUJgI5SqdyxY4e%2Fn9DryxsrXtu1a5cx0CkuLt6xY0dmZiZYkpGRQYzJyMgAxKFsaR8Gb8QxpN2h34SNMaZYD90PlDNsaH%2BYyIdmnW0bnpo2fXpGvrhpkTnsYsZXE707RWWfvvX2OyJBx2%2FKhGVLI5YtjQgM8IWcmhsaAHv8ptyzAsOypRE9NCv5ZlsLdGRSiceDrjRSLHjxpUx1iRUbsDIKiufND6dNEtl0RVQdP27Ybv1mbEnj3Nzc7du3k4lzSHGUm5tbUFAAiEP%2B5uXlGVs3sKioKF6%2FPSFYKhLDSGCE62%2Bjzevr62%2Fg1qMUQNAxP7tIoxW91AN5MAQC%2F1n7jgDo7NmzZ8eOHWlpaVnUlp2dnZeXV1BQkKffcu9uMOTbGFvs3Llz%2B%2Fbts0OeETLmP%2B3GGAOdkpISAB1iC7iR8vPz1Wp1fn4%2B2ANvUbm5ucnJycaMgfLl6T89LmCMPf0ElOM00FHfEeG39duhMQhmRk7Kyutyjw5NRaJxp0C7%2F5Ul%2FxIDOnNDA3R3t5aWqxEL5yxbGnF3h66l5SphnarKCp1OZzesY0XQGeXmNHjwYBosVq5ek6%2FZZxXWydfseyNmFW0MhMV7dOCpj3x5%2Fu7du9VqtcECpKCgQKlUZmdnQ0EEr1h5eXlFRUUMwxQWFqrvbgUFBTk5OcZm3ygqKtq2bdt77601o6ghS0NgA9aNnrYh6JifY6TRapTbb0s9iHl%2BnvyjV0JCgjGPTklJiVKpTElJUd3d4LktLCwsKipSq9XkDQYgQ2CcQnx8%2FIcfbhI26ck%2FegmAjkajSUhIIMbk5OTk5ubm5%2BfTxhTot%2Fz8%2FNzcXAFjzC5fhO23zV8J5cikEh7oyFlGAaCzZfuubgUd0Y1ZquJPFry4UAzoAL5ELJwzNzSgqamxqrKiqamxvq42MMA3YuG0QHHuAAAgAElEQVQcnU6nyk6RSSVwGIKORW7XUW5ODg4Oo6XDCF5MmzZ9XeyWwrKKbmadwtKKdbFbiBl0wFTQGT9uWGJiojFAgTZ02osML34AOgzDFBUVFeq3vLy8rKwshmGMAdNHH33k9bDRJY0FMmi0uxMZbY4NWOZXnNY4E0HHTNVJo5X48eT0I%2FTyS%2FOSk5M1Rra0tDSYhY%2BARUFBAbAFPMwEd7KysgQmSt62bdufpz5GX9dgGIwxWC5otVqYOAdcSHl5efn5%2BQLGGOtLWFJS8vHHHz%2F26DiDBtjZTppyjICOHECnfQ3qiiorsE5HxJOSo54VEiISdFparkIOTproJpNK4O%2Fqt5cD3CQo4wjl6HQ6raaQ%2BHh6dL5b16Pj4ODgOnzAeI%2Ff2rBmhcz%2BMF5Z2I2jzYvKPv1wm3L6s8%2FSfEPCpoLOr7OfM6qXMzIyxBdEarWagA6wTl5eXmFhobGeglqtNjU1NfIfpk2lQ9%2BlgJiwNAQ2YJlZd1rjNAQdc1QnjVZOA8VOgkw%2FLTKpZPy4Ybt27TLCOZqCggLoIEzAQq1Wc0AHWCc1NbW4uNjgAlVqtXrdOlEeWjDGWPmiVquNGUPeosCYlJQUg5ZotdqCgoJFkS9wRLDLrxzKMQ46TwYFBYW%2FsNBqlEOatPjtWfvZ%2BN1pUGN1OOqqqrKCgA6doS0tV6EBC%2Fw6pDFLp9PNDTUwEz99bo8I2wLotJckFOs8HzZ%2F08c7C0u7w69TWFaxadtOMj0g4RsSMBV0QoLdDhQ9lZFqdJ6LoqIimFeMlIpQJDJ3tyL9lpWVZWzIlVarTUhI6OTdRUabYwOWOXWnlc5B0DFHeNJoRa9PburzEzo7sKioyCDrlJSUwEzE5JEG0OGwDnRMJjFwSCUjI0O8h3bO7EBjzl4yLTL0%2BwN3DlhCg05mZqax9nWtVpuWlibeGFOVtJ3j%2BZQjDDqzQmZbeM5Agi%2BmBijcKfz%2F2TsTsCiObfEPuOIjweV6JUpEoyhgQI1EmEFGRCBAiGIQuUncIqK4JSyiEUXAi3FfABWUQQUElEHWUUFQQZ3B7Yk8h7ihqKghGiKjubkm973%2F%2FAPHnFS6Z5qeTRCnv%2F7mq66urq6urq76zalT55SdXhn9TxixVAKdwIBpgQHTYqLCAwOm2Vibgs9aYXa6jbUpHup1dDRvriBXQFkyyTqf%2Bk5dtyUur0S3%2Bjp5xSe%2F3Ro%2FaZJiWQ60HFVBx8rCWCzileb5KuuISkpKwIxqVlYWKORgL%2FQH6ohgoQalJyQPvTydNK9%2F9G2%2Be%2FdudcYP%2FTWvvAb0oKNylWs4aYWfWXl5aVlZWbGSTSQSHWjZcnNzkXJI0AG9PPrV%2BFV%2F%2FdV8vFergeFDeyfEK3UBcfToUVjMSRam6I%2BtsLAQTHXhrekBf7%2BPWy3D655AIeWgh0s%2Btze5c%2B2HerVsG7fvaNarUJVLdJS%2BBXcOFR6bMftLKB5ZZghT3KMKs9PkcnmlpALmp0qKC2uk1TJZU0lxYX39Xblcvm1LLLxZ4B496GjezimgQ5HrfDJp0jerYw4WHNXFmvMjp8QHC44tXxUFzYPhV1XQQZs6RXlx9A4EYoqLi4VCYVpaWlZWVn5%2BPjlvlZ%2Bff%2BjQIWV2vOBygWCP5pUPvs07dzLQT2CpPHa23QV60FGt7pknrXy9TbOSRpUJxwq22jD7T4ZR4fvvv6eTCsaIRKKsrKwDBw4cPHgQvmqQoBw%2BfPjgwYPZ2dmYkh4QiUSqftLOTiOV9S8lJSVHjx4F31sHDx4EZWRY6ZCTk8NgJxAyPHw4R9XCvHbplVGOsgcZaTMYBoklIWHNrhl1BC5qZYvzVl5eXsrKj%2FE21qaoglMjrTY3M%2FJ0t6%2BRVsNcVaWkAlMC6HSMeStzM6N2MnWF1UvKdby8vALmBe1Jyyo4Xq5F9eSC0vLdqZmzAwIZ%2BAZPIejYjTQRbLUtFdpnJo329W7W4mLYPV36bloznqEjKikpEYlEBw8ezMjIALuphw4dgv6QYcYKMvRw5zLcmn7qj5I7ZCaNnuFnRibACSwnJ6ef9Vu7rwE96Kj2inDSir7SaqbfAImIi3uZcKwy1sGBwdPdfvOmdcXKt2PHjuXl5cFXDSb7MjMzs7OzCwoKlF%2FUfGbR%2FMnkZ8kyvGXzOoYupri4WCQSZWdnkz4ocnJyjh07xnBVSUnJ5E%2BcWRbgNU2mKuWYmxkNGTIQhoRPJk3ad%2FBw%2BwGdvJKTIctW4HD1mr6RV1Ds9gY6FLmOl5fXp75TV6yOScvO03w1VmHZ6bTs%2FGUrV3%2FyySRsG8wBAB1w8kBOgLbKOuZmRsvCFzN3KSUlJcXFxfDHr6ioqNUuqKSkZOuW9Sq1ipaSO4pFf%2B5Bs8zJHHAFln4C6%2Bd2v%2BlBR4VXxDxpBYjzpKFa1tRw93qaRMQNCxpMfhgQJinH3MyIZ2%2FZDCatbceOHTvasrWWsPn88eKDZUJ1zNXw7C1b7V8ggTKlY%2Frlqakd3J2nGpTTvZuhmZkZjhOhy1Y0D0VqSV%2B0flVKppD0WERvwPoYqIF2CDp01vHy8vL%2F7POYdRv3ZeXkFZ88cuqsSgKeI6fEeSUn92XlfBMZPdnnL4aPsfUqCwDorFtpKRbx7l5P%2F%2Fnnnx%2FePd6shSN8aVWSoSFZDftbTk42vTPRJMZmRH%2BGO9JPtZTc8bY08eeff254IBaLHEuFDmQy%2FQqsn1%2BfTQ86bN8VTlopNA%2F45UzPupptVeXTIbuffqyViLiCrVSTxBTKgc8mJDioWKtbae7nEhGXoktBfqIM4eCv5mnSm9CvVbV%2FYShbOzylHuVwOByLoeY4QkyaNGlvVo7WkUWNDCniHDZTV%2B3wpbyaIrVP0FHIOl5eXlP9ps1ftGRj3M7UQ3k5R0sLyyqaJ0ybVbIkf93FR06dLSw7ffhoaWp23obtO%2BYtXPzJJLZSHGzSaBk5M2m0WMSTNTVAx3ixbIpYxGPzgvx8P6J3JmrHBH8dxOamZBrBVluxyPGnH29DyS%2BXzxSLHCmdKpoQ1E9gQS2121896LB9NQyTVuZmRqCUIJUsbHgg%2Fvnnn29e2SQRcSND%2F2I2RiHlmJsZWQ77W2amUr9XxSpuudkJIFsiP1r24WFDe2dlZardoVAuDAlWuX9hX9Q2T6k25fTp1RV1dGBsCFn2TbNl2zYV6oDHosk%2BPuRw1eaV3G4L0G5BRxnrwGv1neo3J3B%2BSPg3azdvT0jetzs1c2%2BmcF9WTkqmcHdqZtzuvbEbt4YsWzFrztxJk%2F%2FSEshWwSYMEp3I0KFiEY%2BQi7CS6DQ%2FwtDemzcxzaRTuhqGw3371BEqR4ZaiEWO1y5F%2F%2Fzzz08aqmEOi9IaSR9Y%2BgkstkNpW6TTgw6rWsdJK2U%2BrWCBSfXpmaijIxFx7Uaa4IehjHIgwSRv5%2Fz8fBWRRkHyjIyM8nxXiYjLZiIcy0YJTPJ2VmaflKE3oZ%2Fau3cvJeeOdKgJ5ZibGb1n%2FtZ4Pg8HjE8mTdq4fYfoxJk2ZJ2D%2BUenz5yNRYJAR3pl2n2W9gw6zKxDvmJv70%2B8vb0%2FbtnJeM3DADp8bm9SQUcs4rHvmpwcbVJTU%2Bkdi0oxKSkpLs5j8NX7epsKttrGrR0RGvQeRioM0HV0fL3foackfWCxGkv0idqiBvSg03qt19TUgDhH4aQVNH0Anchl7rDqKn6tNXvKMTczGja0d0x05OHDh4s12FJSUpJ3LslKGsW%2BK6F%2Fty8LExOpIeskJyd7eYxTmH8HiNSQcqAGKKzz%2BRcz9r9i11eEACn%2F%2BKlVMWvpw1sHeFk6eoR2DjrAOu9bv6vJvi9h%2FL6E8YezVhwtEqQleu1LGO%2F90TCWGb5n%2FhbUvKdLX%2FarrigvKyR4oUAgaHU5lTL02bNnT0zMn47KZ%2FgNIKkrbu0Iyu0oh3xu75aSN6%2B6Ukg5kP5t484wQCxatKj14USfoi1qQA86rde6ubk5tON%2BfbtRvgQ8BNBB780YT3r5UXgWU47jvb9r164DBw4Uq74VFRXt2bMnLi4Oc9MwMI73%2Fo4dO9LS0tgsZ6D0MiKRaNeuXWvWRKtUBsrkt0rXvuLEWqEcKDOFdebOX3Cw8NirF%2BoUnTi9eUeSt7e3HnTYt6Xu3QwNDQ26djHUcGe%2B49vGnen5gxGXd%2Fop7Y6Y82R%2FlkIGgq227K%2FVSkrbEQN27tyZmJh44MABSj%2FDfHjo0KFtLZsj1xpLApTz8O7xJw3V1WeDVBIvYSb0AE5gmZiYSCSS1kcUfYpXXgN60Gmlynfv3g2Uo2zSCtq9MtBhnrGifDNffxW0Y8eOnTt3MtvIKf7rduDAge3bt8fFxZESWkrOahxiYZQ5Nqd3NL8b79m3b9%2F2lo19YTxd%2BpbmOBdmeAj3ecauHO%2Fk%2BD5%2FnK0zfxTsE%2Fij2tXuyB1pZWVlYzMCS%2FWyqE4jxzvZ8sfZjOO97%2BhgzbO3gh0MrnA4nD69uip8CxTWiVyzNufI8VfJOqKTZxL3HfjUdyqdcvTKyApfGUS%2B069bD6NOINdR7xd4heEW2Hjo%2BZu83Zn5Qm2d9XTpGxk6NG7tiBl%2B6jjC1LwYn%2F9j8o6WbdeuXZmZmYWFhfSeB2PAzuqOHTuAcgLnzsACeLr0FYt4oHODS8AoapSYWNUATmDptZJbGVDb6LQedFqpeKAcDofD3PQVgo5KlGNuZmQ7on9CQkJ8y5aYmJiRkcFgLwdcUAFVbN%2B%2BfQ0hoWUuKsuz%2FlOGYWF27ty5d%2B9eZQ47wTT7nj17sDBLw75ieRfw7L3x2%2FkrVqz49ttvt23blpiYmJKSAoaYDxw4kPE6bOnp6ampqXv37t2zZ09CQsLmzZs3bNiwcePG9evXg7ENZZQDtUSyzmQfn28io3OOlL4a1hGdPJO0%2F8DUaf4KKUcPOiybsXrJYMqD%2Bdru3ZolRsxpOvbZYUN6L18Wsgz28OBl4cHp%2B2KEWevzhVuOFe0oK95z%2FGjikfz4wwc3pu2NilwVHBa6BHcb6z%2BXlIO20MWyKdDjX7sULRbxgmYN1FbtGffoBIOFXiu5lTG1LU7rQYep1lEHGd3KKPsq6KCjKuVAzhMn2H3q4%2Fapj9sU2Ce7%2BX760T%2Bmec%2F4Ysqc2dPmzJ42e6bv559N8pnsStntPmhFt05ZyZXFF6SOKcmZfOnimaqqqksXzxRlfX5wr7%2B31%2FjJn0yYMtl12lTPaVM9p37q7u3F9%2FxoHGUfNqSXsmwp8etWDheLuFs2hnZU0GGQ5ZBVQbLOJ5MmrVgdc6iwWNesU1R2emdK6lS%2FacooRw865DtSLxwaNHjdSkvKDuMrgs4MvwGUBOtWWoKwQRPQeadfN4U73dipeo%2FWVldZWRj7epuuW2kp2GqbmTQ6M2n0upWWbAROLSvGeeeK3c4Vu8E0lhYf4d3%2B3Q0NX%2FqFYBpU9Ofaogb0oKO01lEHmY2LcgroqEc5%2BNUFBkyrr79bX3%2BXtKDv6GApzE4rKS7EZDoNlAnHSkRcrB2JiKueEULmQgq22nQk0Nm9ezdFosMsyyErh2SdSZMnh4R%2FkybMF53U1TqsvOKT67cltGoFjiwhc7hSUgGNNiwksEZaDWH4ZdZOY862nZz193PHT9LRwfJ3h0cpggSIwU9SmJ0GMcLsdCw2GJKBYVWU86UoZ07adqt1K97fv3uNYFfMnh0x%2B3evWfW1Vdp2K1HOHFHOnFMFH0HizKTRMHWltkSHw%2BEYKNrIWXgrC2M6Y61baUmupcBned0D8LBQvQWpdsos16v9mOgXQq%2BVjANHOwnoQUfpi0AdZDZ%2FgEjQ0ZByzM2M%2FP3cZbIm8JUIXx24TpTL5SmCBLW%2FQ%2FJCcEhUI60mWSpFkIC9dvxaa4mIe%2B1S1JOGaum5MImIu37lcDIHrYRDgwaLRdwOM3VFBx2VaolkHS8vrxmzvkxI3p9fckq7op0jJ89m5BaFfbOSQZCDp9iXv6S4UC6Xy2RNgQHTIFAjrYYdyIB9Vu0tpaODJT4RBLZtiZXL5fX1d8GAVklxITw%2BEB75nSLoFOYsANN8Cz%2FtonAvLDl%2BtFySlxPBEnQ8XfpC5qVC%2B7i1I%2Bjq%2FByOgb9P%2Fx3r39%2Bx%2Fv31Me7fxkyK%2BWbMkHe7rlg6JzsjHvZ1UV8cSno%2FN%2FWjY7nTTxRMgluLRbwOCTrQrugVpcX21rWLITj71GslKx1Z2%2BKEHnQU1zpLHWT8QhB0NKccyBPIBsKQZ6WkQosDBrIUOGI0NzNCloKb8rm9C1LHKDMLhA%2BuYcDKwliw1UYPOliNFNZp9kQdGZ2anVdUdlpz3DlySnz4aNmWnbs%2F%2B2I6ogxzAAvGJiCXy0uKC22sTYHRZbIm4B4217bnNGEhgXK5HORSgQHTKiUVYSGB%2BJegvv6uTNYEv%2BZmRvD4eBZBp%2BjwQgCdRZ92UbgXqAI6oFqLXCIW8UACRFYjh8MJnjf4pQCjxbvnmqUuChlr5%2FbQo%2BUSYWE%2BZkiCjr%2BfOwArdkExUeEQg48pzE6DGG39EyMf5DUK67WSFQ%2BobR2rBx3Fb4ClDjJ%2BgQA68It9Ip5VI4Cgg%2FwBo4gaWSm7JEWQIJfLAZ7wLjJZE6a3sjAOCxocv9ZaodMuTKZhwMrCeNGCmR1DR0dDiQ7UJIV1%2FnBXtCldmF9QWq4e7hw5eTbnSGlC8v6AeUHMZEM5q9LLJUEHBB4w%2FL%2FuU1ck6JAVsnXLP8FJuzA7HSat4Cz5qeoIdPJT7cSiZnWTu9fTb0sTAVAoqrUIOhUF45tbTrlkzVIXhYwFoHOoIJcOOiDNAjmWXC6vkVajxA6kzijNAq6Vy%2BXbtsSStfSmhVEr%2BeDBg4pHF33sK68BPegoqHL2Osj4DSPiyOVyfz93G2tTZTtewhxA0EFxDgTwLxTz5WzOIuiAHB66bJmsSYu3YFMMczOj2bO%2F0IMOWVd01vHy8pr2j8%2BWr4pK2ncgu6i4sLSi2UEjYfFPYVh08kxe8ck0Yf7azdtnBwRSIIbNIVmqVsMIOiXFhWEhgeZmRp7u9nK5HMKtXt5uEygDnbCQQPw8dQQ6XbsY0nUErSyMgUge3j0O%2Fdfl8hliEY9iAU8roBMTFQ59mrmZETwv%2FILsCkRZwDp0aVa7faE6LRjp7FPB6KKPaosa0IMOtdZRB5nBDjL9OyFBB4hB2S%2Fz3x2YUQJZsVwuR3uDIHeRyZpwpoleBlVjEHRAGg%2FKpG3yh0wPOvR3p5B1vLy8vD%2F55IuZs8IjIjfG7UzJyM7ME%2BUcOZ5bfCK%2F5FR%2Byam8kpOHj5UdKixOE%2BbvTElbHbt%2BbtBCivsqNnyDaegFo8fUSKtxxgooWS6Xg0IuIELHAB14CmF2mkzWlCJIkMma%2FP3czc2MdDp1xeFwDA0N%2BvTq2qdXV7QQiKBzvzYX%2Bi9wlkkx6KdF0KHL5EhpFjYJ0FgKDJiGMW9mwORtva1k6sDatsd60KHWP%2Bogt7qknPyGcepHGd9gPHOnD%2F%2BAITGoCYOgmOXlZJEwvGlj9OPHP7zQb%2Foa%2BGsNNDY2VlRULFq0CLGGHsBWxBAAmoEmCuJMkHNAjEzWZGNtynB5%2Bz%2Fl6GBJ%2FpOplFT4%2B7njJwmqx2QloAjkd4cq5NRVzpHSnKOlc7y7KNyz8vJyjpQKsxaDtCYzaTTY4MbFU4aGBmgnELI9V%2Bx288omoBy6nV%2Bdgg6srSMn6YByslKXrltpGRo0WOtrmtp%2FO8ESvtu%2FO1iD1NtKpo6vbXTMea7fiBpISkoC7Ry1l3RiW1c74OluL8xOJ3X6AgOmCbPThdnpavxVqqq6%2BNfRTX%2BkhRpobGysrq7e3bI9evTo%2BfPnWsi0jbJobGwMCwtxmcBXuLNsxmEhgcLsdJBwwBRGiiABmvHrTjlQA%2FBVkh%2Bmv587fJUxUeGQBiqBrAcSdMQi3vGcCcdzJpzIGbshcnh4aOA%2FY5ZGrgxbGha85ptRJ3LGNp8VOqOWTGbSaLA2aWBgEBU%2B6kL5qvHcPoaGBvAHjO4skyLOMTczIkEnK%2F9I7rETK7%2Fiz%2F2kC33fsmFx7rETezPS8O6ojAxTV9DzgBwLNJFBxowTdkA5t67EYg6lQntPl74s20%2FHS4ZLzZ2cnIgRRh9smxrQg85f6n3gwIEAOmyWlGvx41Sm0MMyXllJREWH22j07OC3ffDgweHDh%2Fkt24ULFxobG1%2FrB75de1NZE9LHa1gDni59fb1NKTtiRK%2BeXTgcDp%2Fbm5LA19uUz%2B0NoPOx698f1pU8f%2F688kTwO%2F2ardJBkfjc3pGhQwtS7TKTRis0l8fhcD52%2FfuqEIvDe8eU5U7cED0mbMHgXiZdli8L2ZeSAHvIV5%2BdyBlbXsA%2FnjMBGYVcXk7KmGExHUXGnCJIIAV4zWrLP12ru97MTPSFYBpW5mt0OTrA4nA4EonkL8OM%2FuCV14AedP6schTnkAa16J8Wn9sb%2Byn62VZj6JdTuglSJM4mLJM1KVt2%2FlqPvu258AA641q2DgA6L168CP46gNJ07UaaaNLOKbm9ykMNS07%2FQnVXeAAdZfkD6Oza8H712aD7tc1Lorxc%2F46go%2BwqjIf%2FbAYGBuGL3hNstbUb2RPMB3I4BrD37dM1aNZAwVZb%2Bk6Sk6e7PagboyHEwIBpEAMah7DY%2FnpNaeP3FS%2F%2B3fTLL788f%2F4cJtRYGq15lXWO9QMBKwtjTWbZGEpOLjX%2Fc5jRh9qiBvSg82etoziH8iXgIWlaJitplKqC2aBZA9EsTfzaP33q1kirQb0xRZCg6g6QpBB0%2FHzd2jMr6MtGr4GnT5%2Bea9lu3bolk8noCSAGBpK7Ldvz589%2F%2BeUXZSnZx%2B9O2obt3MrCGFYvi0W8UqG9r3e70LDxdOkbGjQ4MnRoZOjQGX4DFA5OVhbGqBOjRslJ4zQtZGCCdcIy4O%2FnDp8wzuKFhQRCDEWf19HBMiYqnA3oOIzpCQ8Vt3aEcY9O7EHH3Myoc2eDYUOMSw6NFYt4O9a%2FvyrEAncDg%2BZZsFKhPSnIIcMsGQVrZt1KS7GId%2F9WLnSpkBWeVRbgc3tjY8tMGq1qp6osW5bxUGZo55TF%2Ba3m0FLyD8UiR7HIsSD1Q4Ul72H00gGWXqjz50DbFiE96LysdRTn9OrZRVkTB0ypPju%2Fqny6qi4RfL1N4XLpuTC4HFkHrKkquylzPMygvxrQuXXrllQqvX37NvvhU5%2BSfQ3IZDKpVMrn88ePHx8fH19XV6fs2gcPHhw4cGB8y6YtedKVK5fgP3pgwDQYeC6WTak%2BGwRjgEKqUNYywb425KbwFyFAWQ5kvN1Ik3UrLS%2BWTblxZdP9W7kN9eKHdSV119OqzwaVCu1DgwaTiQEIVCq5o4NlYMC0wIBpXy%2F%2B7NrF5bDDam261gt5L3qY1FAGS4nkGgWZrAlZB%2BMdeWMYHAaDRMdhTE%2BAhlKh%2FYjhb6kKOh%2B7%2Fp3EFwiXHBrLBnRKigtBCwd%2Fa6TV%2BBTgB4OUOv%2Fnt%2BdVFTOrzwaBM6l1K5t9ZTDvUJ7qs0FQ5wWpdszptXg2bu0IsYh3sWyK9NxSKIZK7bxU6CAWOVafXdBScsdSoQO9bLjUXK%2Bp0xZ48%2Bc99aDzsi5AzMuwpBxI5dqlKLgAvCIopHh6czc3MwKPCjDX3vT0%2B%2FPFrug66vcV4%2Fv2CUbaDFZjD1%2F6VUNDg0LQ4TkMz8rYq3C91a%2B%2F%2Fvqflu3XX39VNprS42NjY5csWbJ%2B%2FXr6KX2M5jVAgo5AIGAGnby8PJVA5z%2F%2F%2Bc%2F%2F%2Fu%2F%2F%2FvbbbwrL%2Bdtvv%2F3f%2F%2F0fjFiXLxZD7w%2FtvLbFGB2FJ%2BzH2ri6uijcP%2F10ymzGbc2aNaSivcKPBSPXrbS8XD6j8Untnz0WEWp62lB3PQ2VXmHR9cWyKZAE1EQoJcecMQBW78jRWi6Xv3jxAsZdlUY%2BUMj1dLcHx1jC7HSZrAmsCYNeCzw4JCspLnR0sGQj0dmfMBIqQXpu6ceqTF2BRKcZdI75UPaSHG8SdMpyXckdRn0rC2M0OYHmH0mrSPBQYFwAiFYul%2F%2Fnt%2BdwOcWoD1Y4GfD1NhWLeESn2gwc7DtVMis1wlBOaC0N9WK6ISKGPEH4d%2B1SNFx%2B48omscjR1%2Fsd%2BiXgupXD4SQlJRGNVx98pTWgB53m6l60aBGADsOS8pl%2BAyQibt31VHg%2FN69slIi47KX6gq02EhH3yfdX4PJLZT4SERe%2BihppNX1ZL%2FsYiUSiEHQg82k%2BQ598f44c3mr%2FZwsKaW2sTYO%2FDiDPMoRnzZrF5%2FMXLVrEkEZ%2FSu0agAmpupbthx9%2BYJiQev78%2Ba1btyQt29OnTxlSvnjx4t%2F%2F%2FrdYxMM%2Fyh5uY2%2FX3iQL6eE2FntnuVx%2BvaZULOJJzy2FhvqwrkQs4lFwgevwAfv2SUm5fPlylqAj2Gpbdy0NisHw2%2FS0QVIaCNq7YhGv%2BmwQJIahq1WhAnCJv597WbEAcOc%2F%2F%2FnP8%2BfP4V%2B%2BqqBTX38XKhPWmuGKM5hixiXZMlmTMDtNGeigl027kSYcDmd%2FwsgbVzY9f%2F78xpVNADqYgNSkwZdIBjp3NmgGnYsNlL3kaBKCzmFhTNGJM%2BSek58iFvFg6gosI8Mro5h%2FpIuT4THZV1rQrIFiEa%2Fu%2Bsu33IILPPadKvmkqoYBiy%2BXz4DW8uT7K2IRj70MDxAN3svz589b%2Fg84zvAzoxcDvZoPHDiQoRnrT%2Bm0BvSg01y9rYpzzM2M%2BNzeEhH3fLHr%2FdrD92sPwzwUe23NsKDBEhG3%2Buz8hvqz1y5FSUTcgtQx8FXoFHSsLIwvnZiCA5tEfHJZ2HT%2Fab7kXltbiwkYAitXrlyyZMm6desY0qh3qqgw%2F9ChQ2VlZepd3g6vun79%2BqFDh0QiEYUyX31RBXs2bVwXHL16yaKF82HftXMHFmPfPgHGj7UbJpfLz1QcAd8CddfT7tfmwhwE5U%2B2ra0lBV%2FYH7IEHcFWWxB%2Fsun%2BgHVm%2BA0oFdqfK3aru572sK4ESs5m1LSxNoUR%2BsUvj25WrWmoF4Pmr1jEo49bDDHK5qAhc2F2OmUFU7Pxz4F%2Fo09dgaRBLOKtCrHgcDj%2F8OkvFvFAwuTM6%2FOWcVp%2F7OkAACAASURBVGdM0CrGsQKdw5vACRf%2BZudnAujYWJuinwdzMyMQ4aAlMHLlOVQLWBtiqCLKKVgkf67Y7X5tLtY5%2B06VkpuqhzDRee1SVEO9GGZp8R9gq1nZjTSBz%2BSPkjdr6igrOcjtOBzOhg0b2LRnfRqt14AedJ6zd%2FgAQh1UKJ7pN6DV7wETgPdKvFYi4uL%2FHp2CjrmZ0Uy%2FATjcRkdHz6VtycnJOPIxBFTS0Xn8%2BHFVVdU%2FW7Zr164xqNYGfx2wcMHcNS1bRUUFQwFel1MNDQ0RERHwROeK21Il%2FMaNG5G0LTY2FmsyNjYWz4eHh928ebOkuBD%2BreJoSp%2BD0DXozPAbgNMZLLu8pqcNFUWTQEKAJWfzB51cLH39yu77NwT3bwj%2B%2B%2BSnasyhkKCzbUss2J5BykGHGLBSCSjB02NicHDwvn37Elq28Xz70aOGR4Q6we435YMhQ4aMtB3%2BxbQxEaFOgbPshw8fOmrknwm%2BmDZm9Kjha9f%2BEy6vKD%2BFHQ4EAHQWLFpK2VevmIQSnV0b3dYsdSH31cHNystWFsYALjDXhnN8KD%2F2dLcHq9AQA4pHzJbfKcUzNzOivLJWZVT0HNSOIXXP1VgMP8NvALa0Fqnne8pKgkIdExMTlu1Zn0y7NfCmg46qDh88XfrCug9l8K6srZubGVlZGPt6m65fOZziI1PXoGNuZoRmAzds2EDjnLksQQdHRzaBe%2FfuHThwACzNSKXSp0%2BfKrvKw23sim%2FCEhMTExISDh%2FuCIZ%2FqqqqYmJiElu20KDB%2F%2Fr5R2XPruv46upq5Bgy0NTUBLcmIyMiIlatWgU%2BHHCJk0KJiK5BB%2FVsVOrsGurFcWtH2I00gcVZCktO%2FzxhFKfo6AgzYtT4wEuKC8HtJeQpzE4HygHzM5WSCoAqUNwBbrB5f2hwcPDHH38MGlca%2FgqFQsoDdu5s8JZxF3q2Q4cORdCJDX6H4ukzbObbADopggQwdV1SXFgpqaiUVJCayIBuOBHp6W6PthMpxWA%2B1KRT9XTpC7rzdM105pvCWSsLY2gt6gEW%2B5LrhToqfctaT%2Fymgw57cQ6bz0a9NJqDDtd%2B%2BLv9uzPsqJKckZFBB53y8nKtj7gPHjzIysr6tGW7fPkyg0THw21s7D9XZ2RkpKSkdBjQWbduXUbLZm5mhJWv9UpuNcOmpiYSZSC8efNmvHDHjh2YgAQd5pasU9CJDB2KS5RV7e%2FOHPtc1UXRNtamlGViatgfh%2BrCKTAgG3RUhxQFy7tQNOLv596rZxedgs7bxp0%2F%2BsiFDjoBAQHGPTqB86zdm%2BdQQCd45lAAGphrAyGNjbUpujDD5gEkhxId9P%2BFCXQagPkjmEIC4QpFmUynd1cpc7QfaGJi8uDBA1Ubtj69hjXwRoOOquIclVo2%2B8QU0PH09PRobSNVIiQSyaBBg0DNSOEvObD9rru6bNkyknWio6Nx2GuTgB50dFrtp0%2BfRpSBwI0bN%2FCO5NwWgg4DMcMpEnQ8PT0ntLZ5eHhgi21VRyc%2F1U7tTq1WmqjqX3Nc6Y04Qq4DZ%2F8VU1JaWRiD3UL6L5lS16ADLsfpoLN27T%2BhGDbWpnTQWb14DJgAgDoBoQ5iHEVHB6wIerrb40wW%2BYA6DYMVHNDlAm3iUqG9Tu%2BoSeYo1Fm0aJHaLVx%2FoXo18EaDTnsQ55ibGVFAx8XFxdHRkad84%2FP5OGx4eXlJJJKRtkPBvzHld5zjmJQUAY5qEHj69GlGRsayZcuWLFmSkZFBOfvqD%2FWgo%2Bs6r66u3rFjR2xsbHJy8r179yi3u3fvXnJy8ubNmwF08vLyFOIyGWlhYYEt0MPDY9y4ccpbK4%2FP53%2F00UeYvlXQwYUwavRoT76%2FQtcoYh6cZLKm%2Bvq76GsFZpdwOob5Woazgq22pAIHGUblPHMzo%2FYPOuiOftuWWGWrrsAHFpIQQ7Vo9xRUMlofAFvM2r2FFnMjhTo1NTVqNG%2F9JWrXwJsLOu1EnKMQdJycnJSxDhiUw2EDQAfVA8nP8nWxjOzhNjZy1fLk5OSdO3d2mKkroIrk5OS2nbqiMA3D4YULFwB0ioryKbhMPxxhPQxboIeHh5OTkzLW4fP5zs7O7EHHbqQJrg9Xo1Nretqgqn8l0JjBD4dcTY2RagRYgo7J25179uzp5ORIF7qoEePIHUUvalhIID0r9hKdSkkFOGavlFSAAjVdogM6yzFR4TArRy%2BDjmIiQ4eCGZ6mpw1gBwHNKOjojhpmqxfqqPFRa%2BWSNxd02ok4RxnowOAByrzkL%2FRZOMx0DNCZF%2FjlqlWrIiMjXxfQef78%2Bb1791avXh0dHS0Wix8%2FfkwyRFVV1YoVK1a1bK8d6MA%2FeOYOnZy6AtBxcnIaP368%2B183FxcX55aNPejwub1VXW9F6QdVBR1QHAZNW7SPp7aaDtYbG9BBU3LaAh2bEX%2BxE21uZtTDqJOLizMddPz8pnbtYti1i%2BHf%2FtZr4fQxFB2d1YvHDLN4z7hHJ1Cvxkm9ZoedsiY0DoQiHDAniPNcWAm6DlhZGBek2pHSMoodBF0XQNX8SaGOXlOH8uXq9PANBZ32I85hAB13d3cSaLy8vLDDIuOVGQx8XSQ6fr5us2Z%2BFh4eHhER8bqATmNj4%2Fnz5wFAc3NzHzx4QAGdpUuXhrdsbw7oODs7k83Sy8vL1dVVDdBBW4VqdHxNTxvYLCknxycba1PKwivN563MzYwEW22PCD%2FLPVJE7ocL9opFPJy6Qu%2FiH7nz8dPWJLApZpxYxIsMHYoP2LmzQf9%2B3el5juONMDAw4HA4BgYGvhN7UEBn0rjO%2Fft1